# Altium project esp32-gps-collar.PrjPcb (part 1 of 2)
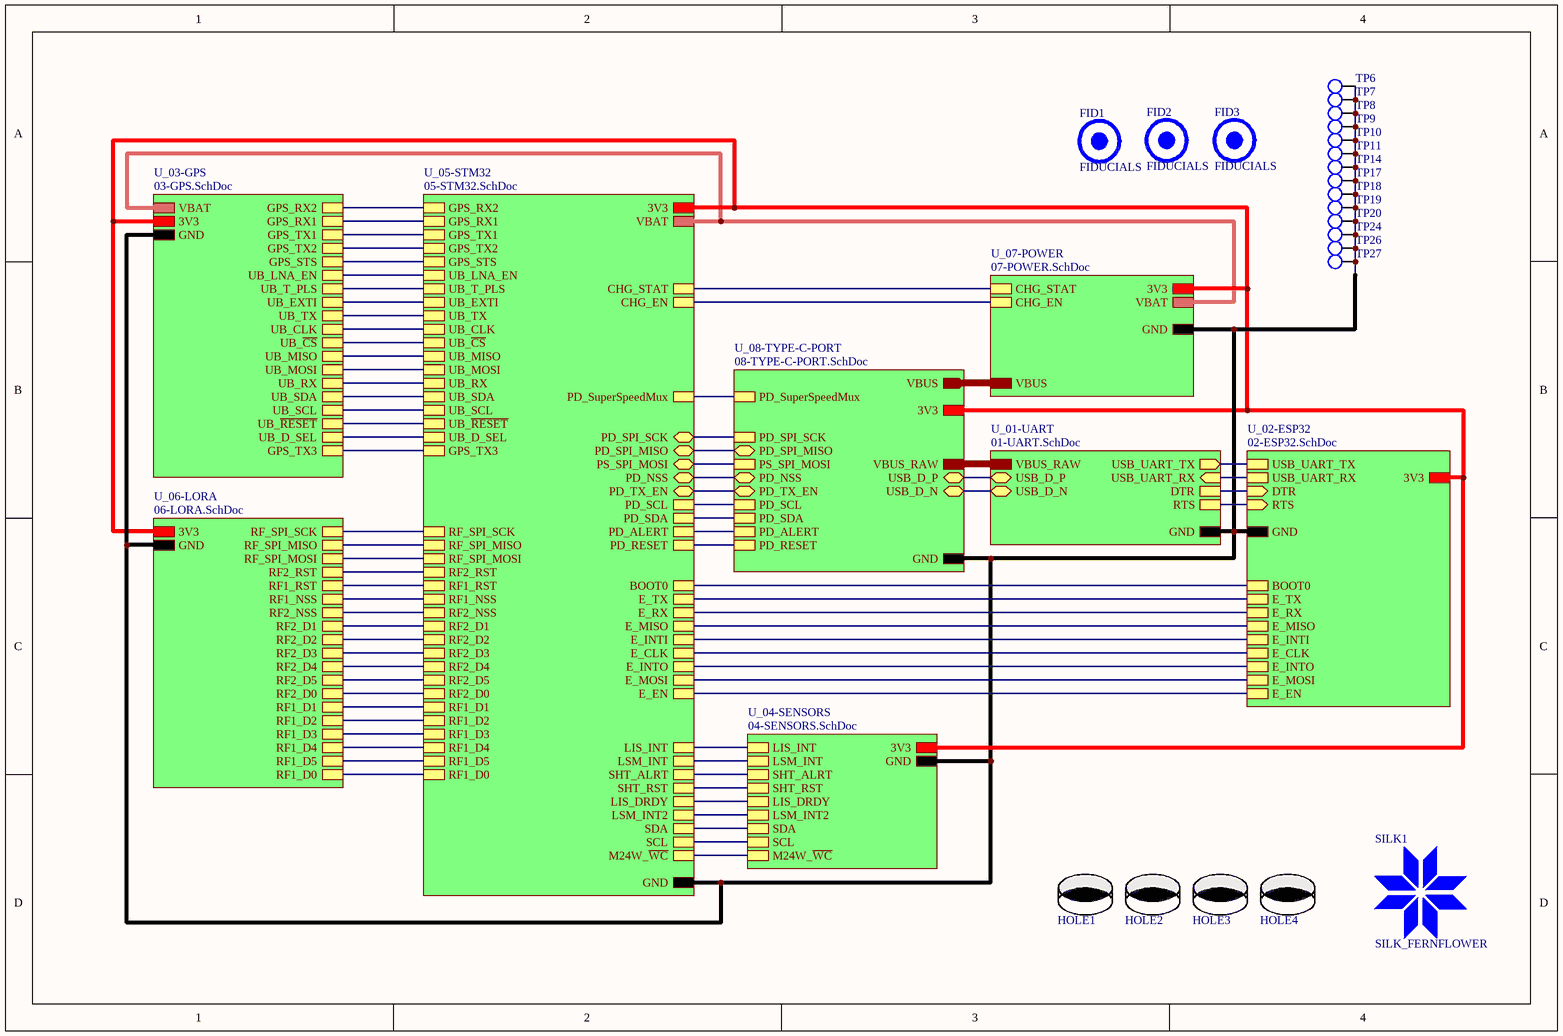
[diagram p0: 00-OVERVIEW.SchDoc]
11 sheets, 324 parts. Net scope: hierarchical (ports join the sheet entries above them; power ports are global).
Board file: SAC100001-PB-Collar.PcbDoc
Sheets:
  00-OVERVIEW.SchDoc
    U_01-UART = 01-UART.SchDoc
    U_02-ESP32 = 02-ESP32.SchDoc
    U_05-STM32 = 05-STM32.SchDoc
    U_07-POWER = 07-POWER.SchDoc
    U_08-TYPE-C-PORT = 08-TYPE-C-PORT.SchDoc
    U_03-GPS = 03-GPS.SchDoc
    U_04-SENSORS = 04-SENSORS.SchDoc
    U_06-LORA = 06-LORA.SchDoc
  000-PDN.SchDoc
  Notes.SchDoc

## Sheet 00-OVERVIEW.SchDoc
size A4

### Parts
FID1  FIDUCIALS  [FID_C_2-1]  (no BOM)
FID2  FIDUCIALS  [FID_C_5-3-1]  (no BOM)
FID3  FIDUCIALS  [FID_C_2-1]  (no BOM)
HOLE1  HOLE_M3  [HOLE_M3]  (value not drawn)  (no BOM)
HOLE2  HOLE_M3  [HOLE_M3]  (value not drawn)  (no BOM)
HOLE3  HOLE_M3  [HOLE_M3]  (value not drawn)  (no BOM)
HOLE4  HOLE_M3  [HOLE_M3]  (value not drawn)  (no BOM)
SILK1  SILK_FERNFLOWER  [SILK_FERNFLOWER]  (no BOM)
TP6  TEST_POINT  [THOOK_0.8-1]  (value not drawn)  (no BOM)
TP7  TEST_POINT  [THOOK_0.8-1]  (value not drawn)  (no BOM)
TP8  TEST_POINT  [THOOK_0.8-1]  (value not drawn)  (no BOM)
TP9  TEST_POINT  [THOOK_0.8-1]  (value not drawn)  (no BOM)
TP10  TEST_POINT  [THOOK_0.8-1]  (value not drawn)  (no BOM)
TP11  TEST_POINT  [THOOK_0.8-1]  (value not drawn)  (no BOM)
TP14  TEST_POINT  [THOOK_0.8-1]  (value not drawn)  (no BOM)
TP17  TEST_POINT  [THOOK_0.8-1]  (value not drawn)  (no BOM)
TP18  TEST_POINT  [THOOK_0.8-1]  (value not drawn)  (no BOM)
TP19  TEST_POINT  [THOOK_0.8-1]  (value not drawn)  (no BOM)
TP20  TEST_POINT  [THOOK_0.8-1]  (value not drawn)  (no BOM)
TP24  TEST_POINT  [THOOK_0.8-1]  (value not drawn)  (no BOM)
TP26  TEST_POINT  [THOOK_0.8-1]  (value not drawn)  (no BOM)
TP27  TEST_POINT  [THOOK_0.8-1]  (value not drawn)  (no BOM)

### Sub-sheets
U_01-UART = 01-UART.SchDoc: GND, VBUS_RAW, USB_D_P (bidir), USB_UART_TX (out), USB_UART_RX (in), DTR, RTS, USB_D_N (bidir)
U_02-ESP32 = 02-ESP32.SchDoc: USB_UART_RX, GND, 3V3, DTR (in), RTS (in), USB_UART_TX, E_EN, E_MISO, E_INTI, E_CLK, E_INTO, E_MOSI, E_TX, E_RX, BOOT0
U_03-GPS = 03-GPS.SchDoc: GPS_RX2, GPS_RX1, GPS_TX1, GPS_TX2, GPS_STS, UB_LNA_EN, UB_T_PLS, UB_EXTI, UB_TX, UB_CLK, UB_~{CS}, UB_MISO, UB_MOSI, UB_RX, UB_SDA, UB_SCL, UB_~{RESET}, VBAT, 3V3, GND, UB_D_SEL, GPS_TX3
U_04-SENSORS = 04-SENSORS.SchDoc: LIS_INT, LSM_INT, SHT_ALRT, SHT_RST, LIS_DRDY, GND, 3V3, LSM_INT2, SCL, SDA, M24W_~{WC}
U_05-STM32 = 05-STM32.SchDoc: CHG_EN, PD_SuperSpeedMux, PD_TX_EN (bidir), PD_SDA, PD_RESET, GND, PD_NSS (bidir), CHG_STAT, E_MISO, E_INTI, E_CLK, E_INTO, E_MOSI, E_EN, PS_SPI_MOSI (bidir), PD_SPI_SCK (bidir), PD_SPI_MISO (bidir), BOOT0, E_RX, E_TX, PD_ALERT, VBAT, 3V3, PD_SCL, UB_D_SEL, UB_TX, UB_~{CS}, UB_~{RESET}, UB_LNA_EN, GPS_STS, GPS_RX2, GPS_RX1, GPS_TX1, GPS_TX2, GPS_TX3, UB_EXTI, UB_T_PLS, UB_RX, UB_SDA, UB_MISO, UB_MOSI, UB_SCL, UB_CLK, LIS_INT, SHT_ALRT, SHT_RST, LSM_INT, LIS_DRDY, SCL, SDA, LSM_INT2, RF_SPI_MISO, RF_SPI_MOSI, RF2_RST, RF1_RST, RF1_NSS, RF_SPI_SCK, RF1_D3, RF1_D4, RF2_D3, RF1_D5, RF1_D0, RF1_D1, RF2_D0, RF2_D2, RF2_D5, RF1_D2, RF2_D4, RF2_D1, RF2_NSS, M24W_~{WC}
U_06-LORA = 06-LORA.SchDoc: RF_SPI_MISO, RF_SPI_MOSI, RF2_RST, RF1_RST, RF1_NSS, RF2_NSS, RF2_D1, RF2_D2, RF2_D3, RF2_D4, RF2_D5, RF2_D0, RF1_D1, RF1_D2, RF1_D3, RF1_D4, RF1_D5, RF1_D0, RF_SPI_SCK, 3V3, GND
U_07-POWER = 07-POWER.SchDoc: VBAT, GND, 3V3, VBUS, CHG_EN, CHG_STAT
U_08-TYPE-C-PORT = 08-TYPE-C-PORT.SchDoc: PD_SuperSpeedMux, PD_SPI_MISO (bidir), PD_NSS (bidir), PD_TX_EN (bidir), PD_SCL, PD_SDA, PD_ALERT, PD_RESET, GND, 3V3, VBUS_RAW, USB_D_P (bidir), PD_SPI_SCK, USB_D_N (bidir), VBUS (out), PS_SPI_MOSI

### Nets
3V3: sheet U_02-ESP32/3V3, sheet U_05-STM32/3V3, sheet U_07-POWER/3V3, sheet U_08-TYPE-C-PORT/3V3, sheet U_03-GPS/3V3, sheet U_04-SENSORS/3V3, sheet U_06-LORA/3V3
GND: TP6.1 TP7.1 TP8.1 TP9.1 TP10.1 TP11.1 TP14.1 TP17.1 TP18.1 TP19.1 TP20.1 TP24.1 TP26.1 TP27.1 ; sheet U_01-UART/GND, sheet U_02-ESP32/GND, sheet U_05-STM32/GND, sheet U_07-POWER/GND, sheet U_08-TYPE-C-PORT/GND, sheet U_03-GPS/GND, sheet U_04-SENSORS/GND, sheet U_06-LORA/GND
VBUS: sheet U_07-POWER/VBUS, sheet U_08-TYPE-C-PORT/VBUS
BOOT0: sheet U_02-ESP32/BOOT0, sheet U_05-STM32/BOOT0
C_D0_N: sheet U_01-UART/USB_D_N, sheet U_08-TYPE-C-PORT/USB_D_N
C_D0_P: sheet U_01-UART/USB_D_P, sheet U_08-TYPE-C-PORT/USB_D_P
CHG_ENr: sheet U_05-STM32/CHG_EN, sheet U_07-POWER/CHG_EN
CHG_STATr: sheet U_05-STM32/CHG_STAT, sheet U_07-POWER/CHG_STAT
CPRX: sheet U_01-UART/USB_UART_RX, sheet U_02-ESP32/USB_UART_RX
CPTX: sheet U_01-UART/USB_UART_TX, sheet U_02-ESP32/USB_UART_TX
DTR: sheet U_01-UART/DTR, sheet U_02-ESP32/DTR
E_CLK: sheet U_02-ESP32/E_CLK, sheet U_05-STM32/E_CLK
E_EN: sheet U_02-ESP32/E_EN, sheet U_05-STM32/E_EN
E_INTI: sheet U_02-ESP32/E_INTI, sheet U_05-STM32/E_INTI
E_INTO: sheet U_02-ESP32/E_INTO, sheet U_05-STM32/E_INTO
E_MISO: sheet U_02-ESP32/E_MISO, sheet U_05-STM32/E_MISO
E_MOSI: sheet U_02-ESP32/E_MOSI, sheet U_05-STM32/E_MOSI
E_RX: sheet U_02-ESP32/E_RX, sheet U_05-STM32/E_RX
E_TX: sheet U_02-ESP32/E_TX, sheet U_05-STM32/E_TX
GPS_TX3: sheet U_05-STM32/GPS_TX3, sheet U_03-GPS/GPS_TX3
GPS_VBAT: sheet U_05-STM32/VBAT, sheet U_07-POWER/VBAT, sheet U_03-GPS/VBAT
LIS_INT: sheet U_05-STM32/LIS_INT, sheet U_04-SENSORS/LIS_INT
M24W_WC: sheet U_05-STM32/M24W_~{WC}, sheet U_04-SENSORS/M24W_~{WC}
PD_ALERT: sheet U_05-STM32/PD_ALERT, sheet U_08-TYPE-C-PORT/PD_ALERT
PD_RESET: sheet U_05-STM32/PD_RESET, sheet U_08-TYPE-C-PORT/PD_RESET
PD_SSMUX: sheet U_05-STM32/PD_SuperSpeedMux, sheet U_08-TYPE-C-PORT/PD_SuperSpeedMux
PD_TX_EN: sheet U_05-STM32/PD_TX_EN, sheet U_08-TYPE-C-PORT/PD_TX_EN
PDI2C_SCL: sheet U_05-STM32/PD_SCL, sheet U_08-TYPE-C-PORT/PD_SCL
PDI2C_SDA: sheet U_05-STM32/PD_SDA, sheet U_08-TYPE-C-PORT/PD_SDA
PDSPI_MISO: sheet U_05-STM32/PD_SPI_MISO, sheet U_05-STM32/UB_MISO, sheet U_08-TYPE-C-PORT/PD_SPI_MISO, sheet U_03-GPS/UB_MISO
PDSPI_MOSI: sheet U_05-STM32/PS_SPI_MOSI, sheet U_05-STM32/UB_MOSI, sheet U_08-TYPE-C-PORT/PS_SPI_MOSI, sheet U_03-GPS/UB_MOSI
PDSPI_NSS: sheet U_05-STM32/PD_NSS, sheet U_08-TYPE-C-PORT/PD_NSS
PDSPI_SCK: sheet U_05-STM32/PD_SPI_SCK, sheet U_05-STM32/UB_CLK, sheet U_08-TYPE-C-PORT/PD_SPI_SCK, sheet U_03-GPS/UB_CLK
RF1_D0: sheet U_05-STM32/RF1_D0, sheet U_06-LORA/RF1_D0
RF1_D1: sheet U_05-STM32/RF1_D1, sheet U_06-LORA/RF1_D1
RF1_D2: sheet U_05-STM32/RF1_D2, sheet U_06-LORA/RF1_D2
RF1_D3: sheet U_05-STM32/RF1_D3, sheet U_06-LORA/RF1_D3
RF1_D4: sheet U_05-STM32/RF1_D4, sheet U_06-LORA/RF1_D4
RF1_D5: sheet U_05-STM32/RF1_D5, sheet U_06-LORA/RF1_D5
RF1_NSS: sheet U_05-STM32/RF1_NSS, sheet U_06-LORA/RF1_NSS
RF1_RST: sheet U_05-STM32/RF1_RST, sheet U_06-LORA/RF1_RST
RF2_D0: sheet U_05-STM32/RF2_D0, sheet U_06-LORA/RF2_D0
RF2_D1: sheet U_05-STM32/RF2_D1, sheet U_06-LORA/RF2_D1
RF2_D2: sheet U_05-STM32/RF2_D2, sheet U_06-LORA/RF2_D2
RF2_D3: sheet U_05-STM32/RF2_D3, sheet U_06-LORA/RF2_D3
RF2_D4: sheet U_05-STM32/RF2_D4, sheet U_06-LORA/RF2_D4
RF2_D5: sheet U_05-STM32/RF2_D5, sheet U_06-LORA/RF2_D5
RF2NSS: sheet U_05-STM32/RF2_NSS, sheet U_06-LORA/RF2_NSS
RF2RST: sheet U_05-STM32/RF2_RST, sheet U_06-LORA/RF2_RST
RF_MISO: sheet U_05-STM32/RF_SPI_MISO, sheet U_06-LORA/RF_SPI_MISO
RF_MOSI: sheet U_05-STM32/RF_SPI_MOSI, sheet U_06-LORA/RF_SPI_MOSI
RF_SCK: sheet U_05-STM32/RF_SPI_SCK, sheet U_06-LORA/RF_SPI_SCK
RTS: sheet U_01-UART/RTS, sheet U_02-ESP32/RTS
SCL: sheet U_05-STM32/SCL, sheet U_04-SENSORS/SCL
SDA: sheet U_05-STM32/SDA, sheet U_04-SENSORS/SDA
SHT_ALERT: sheet U_05-STM32/SHT_ALRT, sheet U_04-SENSORS/SHT_ALRT
SHT_RST: sheet U_05-STM32/SHT_RST, sheet U_04-SENSORS/SHT_RST
UB_~{CS}: sheet U_05-STM32/UB_~{CS}, sheet U_03-GPS/UB_~{CS}
UB_EXTI: sheet U_05-STM32/UB_EXTI, sheet U_03-GPS/UB_EXTI
UB_LNA_EN: sheet U_05-STM32/UB_LNA_EN, sheet U_03-GPS/UB_LNA_EN
UB_~{RST}: sheet U_05-STM32/UB_~{RESET}, sheet U_03-GPS/UB_~{RESET}
UB_RX: sheet U_05-STM32/UB_RX, sheet U_03-GPS/UB_RX
UB_SCL: sheet U_05-STM32/UB_SCL, sheet U_03-GPS/UB_SCL
UB_SDA: sheet U_05-STM32/UB_SDA, sheet U_03-GPS/UB_SDA
UB_TPULS: sheet U_05-STM32/UB_T_PLS, sheet U_03-GPS/UB_T_PLS
UB_TX: sheet U_05-STM32/UB_TX, sheet U_03-GPS/UB_TX
VBUS_RAW: sheet U_01-UART/VBUS_RAW, sheet U_08-TYPE-C-PORT/VBUS_RAW
NetCFG7_1: sheet U_05-STM32/LSM_INT2, sheet U_04-SENSORS/LSM_INT2
NetJ2_2: sheet U_05-STM32/GPS_RX2, sheet U_03-GPS/GPS_RX2
NetJ3_2: sheet U_05-STM32/GPS_TX2, sheet U_03-GPS/GPS_TX2
NetJ4_2: sheet U_05-STM32/GPS_TX1, sheet U_03-GPS/GPS_TX1
NetJ5_2: sheet U_05-STM32/GPS_RX1, sheet U_03-GPS/GPS_RX1
NetR12_1: sheet U_05-STM32/GPS_STS, sheet U_03-GPS/GPS_STS
NetR21_1: sheet U_05-STM32/UB_D_SEL, sheet U_03-GPS/UB_D_SEL
NetR23_1: sheet U_05-STM32/LIS_DRDY, sheet U_04-SENSORS/LIS_DRDY
NetU8_4: sheet U_05-STM32/LSM_INT, sheet U_04-SENSORS/LSM_INT

Not connected (* = marked no-connect by the designer): HOLE1 4; HOLE2 4; HOLE3 4; HOLE4 4

## Sheet 01-UART.SchDoc
size A4; DocumentNumber: 1; SheetNumber: 1; SheetTotal: 8
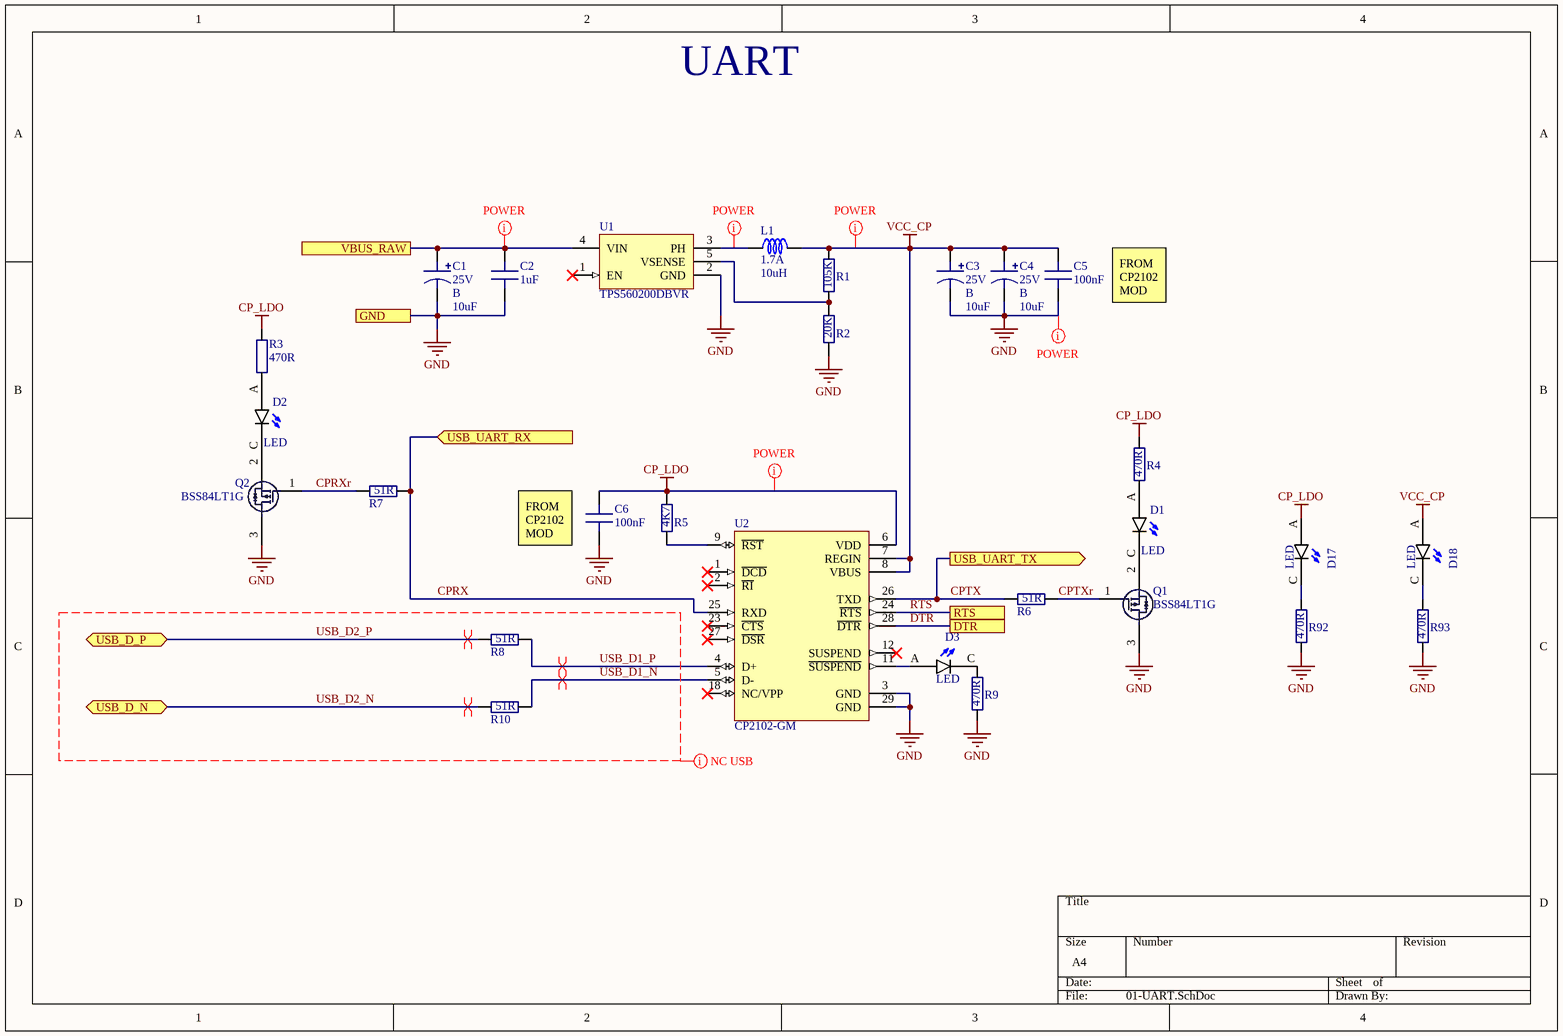
[diagram p1: 01-UART.SchDoc]

### Parts
C1  Voltage: 25V  Size: B  [CAP_SIZE_B]  (hidden comment: 10uF)
C2  1uF  [C0805]
C3  Voltage: 25V  Size: B  [CAP_SIZE_B]  (hidden comment: 10uF)
C4  Voltage: 25V  Size: B  [CAP_SIZE_B]  (hidden comment: 10uF)
C5  100nF  [C0603]
C6  100nF  [C0603]
D1  LED  [LED_0604]
D2  LED  [LED_0604]
D3  LED  [LED_0604]
D17  LED  [LED_0604]
D18  LED  [LED_0604]
L1  Current: 1.7A  Inductivity: 10uH  [L_CDRH6D28]  (hidden comment: *)
Q1  BSS84LT1G  [SOT-23_TO-236]
Q2  BSS84LT1G  [SOT-23_TO-236]
R1  Resistance: 105K  [R0603]
R2  Resistance: 20K  [R0603]
R3  Resistance: 470R  [R0603]
R4  Resistance: 470R  [R0603]
R5  Resistance: 4K7  [R0603]
R6  Resistance: 51R  [R0402]
R7  Resistance: 51R  [R0402]
R8  Resistance: 51R  [R0402]
R9  Resistance: 470R  [R0603]
R10  Resistance: 51R  [R0402]
R92  Resistance: 470R  [R0603]
R93  Resistance: 470R  [R0603]
U1  TPS560200DBVR  [SOT-23-5]
U2  CP2102-GM  [QFN50P500X500X100-29N]

### Ports
DTR, GND, RTS, USB_D_N (bidir), USB_D_P (bidir), USB_UART_RX (in), USB_UART_TX (out), VBUS_RAW

### Nets
CP_LDO: C6.2 D17.A R3.2 R4.2 R5.2 U2.6(VDD)
GND: C1.2 C2.1 C3.2 C4.2 C5.1 C6.1 Q1.3(D) Q2.3(D) R2.1 R9.1 R92.1 R93.1 U1.2(GND) U2.3(GND) U2.29(GND) ; port GND
VCC_CP: C3.1 C4.1 C5.2 D18.A L1.2 R1.2 U2.7(REGIN) U2.8(VBUS)
CPRX: R7.2 U2.25(RXD) ; port USB_UART_RX
CPRXr: Q2.1(G) R7.1
CPTX: R6.1 U2.26(TXD) ; port USB_UART_TX
CPTXr: Q1.1(G) R6.2
DTR: U2.28(~{DTR}) ; port DTR
RTS: U2.24(~{RTS}) ; port RTS
USB_D1_N: R10.2 U2.5(D-)
USB_D1_P: R8.2 U2.4(D+)
USB_D2_N: R10.1 ; port USB_D_N  [project net C_D0_N]
USB_D2_P: R8.1 ; port USB_D_P  [project net C_D0_P]
VBUS_RAW: C1.1 C2.2 U1.4(VIN) ; port VBUS_RAW
NetD1_A: D1.A R4.1
NetD1_C: D1.C Q1.2(S)
NetD2_A: D2.A R3.1
NetD2_C: D2.C Q2.2(S)
NetD3_A: D3.A U2.11(~{SUSPEND})
NetD3_C: D3.C R9.2
NetD17_C: D17.C R92.2
NetD18_C: D18.C R93.2
NetL1_1: L1.1 U1.3(PH)
NetR1_1: R1.1 R2.2 U1.5(VSENSE)
NetR5_1: R5.1 U2.9(~{RST})

Not connected (* = marked no-connect by the designer): U1 1(EN)*; U2 1(~{DCD})* 2(~{RI})* 12(SUSPEND)* 18(NC/VPP)* 23(~{CTS})* 27(~{DSR})*

### Layout directives
differential pair: C_D0_N, C_D0_P, USB_D1_N, USB_D1_P
net class USB: USB_D1_N, USB_D1_P, USB_D2_N, USB_D2_P
net class POWER_NET_CLASS: CP_LDO, GND, NetL1_1, VBUS_RAW, VCC_CP

### Notes on the sheet
- UART
- FROM
  CP2102
  MOD
- (near C6) FROM
  CP2102
  MOD

### Library data of the parts
C1 C3 C4 = CAP_B_10uF_25V: Tantalum capacitor; Capacity: 10uF; Value: 10uF
C2 = C0805_1uF_25V: Ceramic capacitor; Voltage: 25V; Capacity: 1uF; Size: 0805; Value: 1uF
C5 C6 = C0603_100nF_16V: Ceramic capacitor; Voltage: 16V; Capacity: 100nF; Size: 0603; Value: 100nF
D1-D3 D17 D18 = LED: Led General; MF: Dialight; MP: 598-8140-107F; SnapEDA_Link: https://www.snapeda.com/parts/598-8140-107F/Dialight/view-part/?ref=snap; Price: None; Availability: Unavailable; Package: 0805 Dialight; Value: *
L1 = L_CDRH6D28_10uH_1.7A: Inductor Generic; Value: *; Size: CDHR6D28; Url: http://www.kosmodrom.com.ua/el.php?name=CDRH6D28NP-100NC
Q1 Q2 = BSS84LT1G: Power MOSFET Single P-Channel SOT-23 -50 V, 10 
R1 = R0603_105K_1%: Resistor General; Tolerance: 1%; Size: 0603
R2 = R0603_20K_1%: Resistor General; Tolerance: 1%; Size: 0603
R3 R4 R9 R92 R93 = R0603_470R: Resistor General; Tolerance: 5%; Size: 0603
R5 = R0603_4K7: Resistor General; Tolerance: 5%; Size: 0603
R6-R8 R10 = R0402_51R: Resistor General; Tolerance: *; Size: 0402
U1 = TPS560200DBVR: TPS560200 4.5-V to 17-V Input, 500-mA Synchronous Step-Down Converter With Advanced Eco-Mode™
U2 = CP2102-GM: SINGLE-CHIP USB-TO-UART BRIDGE; MP: CP2102GM; MF: Silicon Labs; Availability: Unavailable; Package: VFQFN-28 Vishay Siliconix; Price: None; SnapEDA_Link: https://www.snapeda.com/parts/CP2102GM/Silicon%20Labs/view-part/?ref=snap; Value: *

## Sheet 02-ESP32.SchDoc
size A4; DocumentNumber: 2; SheetNumber: 2; SheetTotal: 8
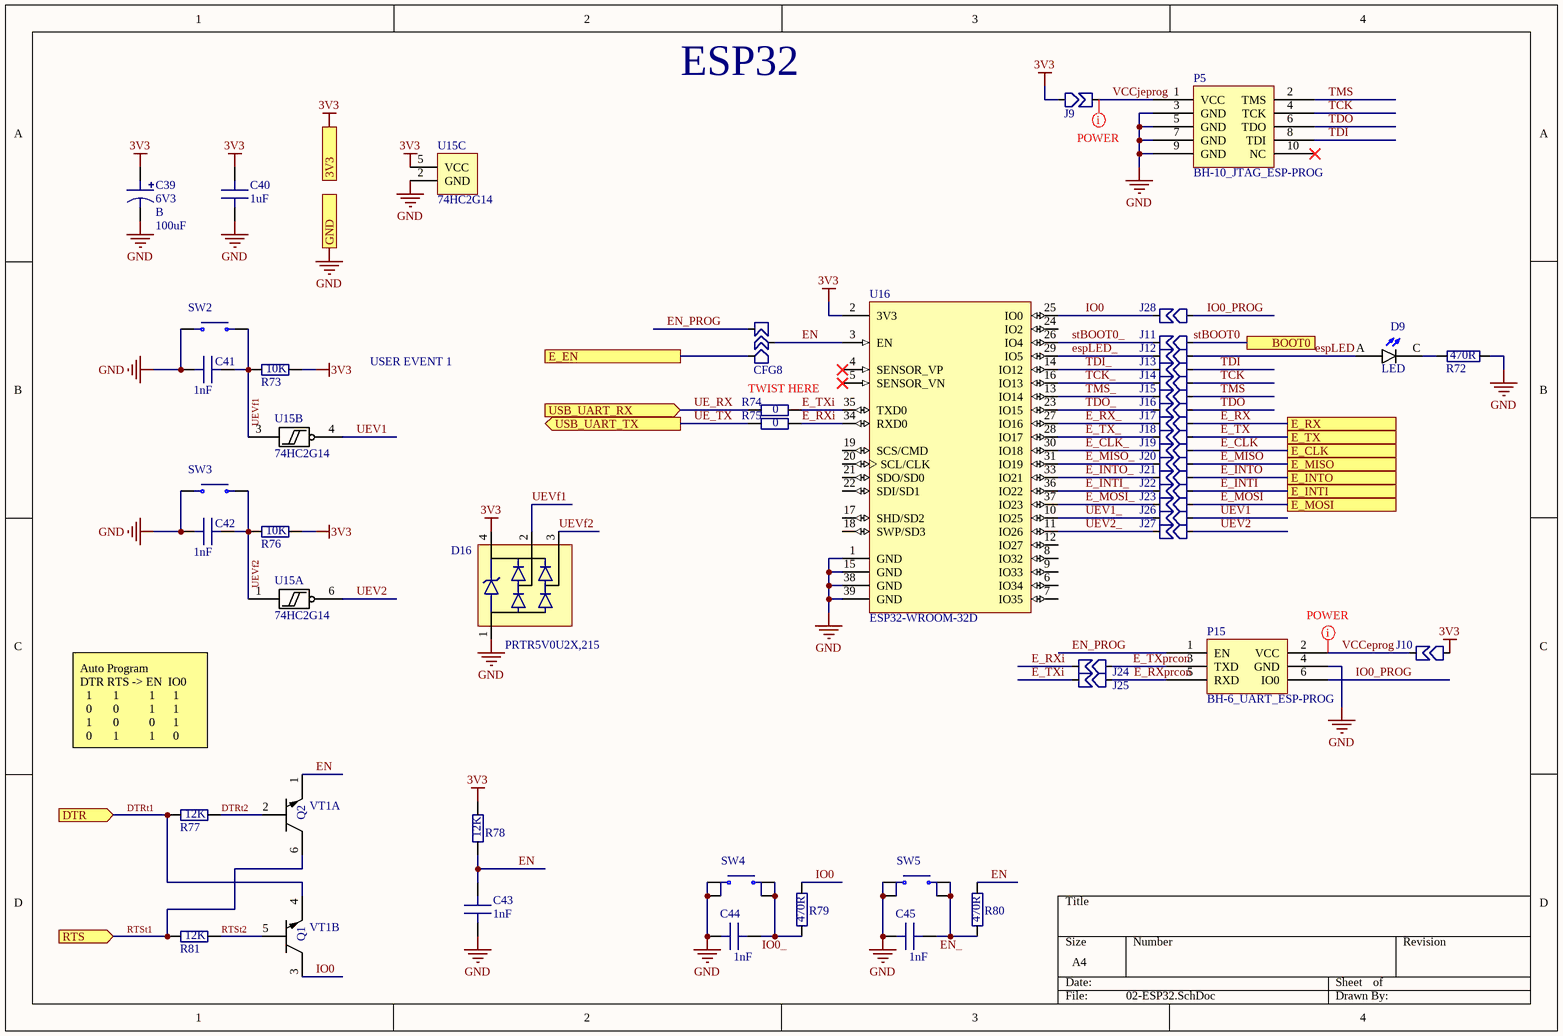
[diagram p2: 02-ESP32.SchDoc]

### Parts
C39  Voltage: 6V3  Size: B  [CAP_SIZE_B]  (hidden comment: 100uF)
C40  1uF  [C0805]
C41  1nF  [C0603]
C42  1nF  [C0603]
C43  1nF  [C0603]
C44  1nF  [C0603]
C45  1nF  [C0603]
CFG8  CFG3_ORTH  [CFG_0603]  (value not drawn)  (no BOM)
D9  LED  [LED_0604]
D16  PRTR5V0U2X,215  [SOT143B]
J9  CFG2  [CFG_J_0603]  (value not drawn)  (no BOM)
J10  CFG2  [CFG_J_0603]  (value not drawn)  (no BOM)
J11  CFG2  [CFG_J_0603]  (value not drawn)  (no BOM)
J12  CFG2  [CFG_J_0603]  (value not drawn)  (no BOM)
J13  CFG2  [CFG_J_0603]  (value not drawn)  (no BOM)
J14  CFG2  [CFG_J_0603]  (value not drawn)  (no BOM)
J15  CFG2  [CFG_J_0603]  (value not drawn)  (no BOM)
J16  CFG2  [CFG_J_0603]  (value not drawn)  (no BOM)
J17  CFG2  [CFG_J_0603]  (value not drawn)  (no BOM)
J18  CFG2  [CFG_J_0603]  (value not drawn)  (no BOM)
J19  CFG2  [CFG_J_0603]  (value not drawn)  (no BOM)
J20  CFG2  [CFG_J_0603]  (value not drawn)  (no BOM)
J21  CFG2  [CFG_J_0603]  (value not drawn)  (no BOM)
J22  CFG2  [CFG_J_0603]  (value not drawn)  (no BOM)
J23  CFG2  [CFG_J_0603]  (value not drawn)  (no BOM)
J24  CFG2  [CFG_J_0603]  (value not drawn)  (no BOM)
J25  CFG2  [CFG_J_0603]  (value not drawn)  (no BOM)
J26  CFG2  [CFG_J_0603]  (value not drawn)  (no BOM)
J27  CFG2  [CFG_J_0603]  (value not drawn)  (no BOM)
J28  CFG2  [CFG_J_0603]  (value not drawn)  (no BOM)
P5  BH-10_JTAG_ESP-PROG  [BH-10-SMD-1.27]
P15  BH-6_UART_ESP-PROG  [BH-6-SMD-1.27]
R72  Resistance: 470R  [R0603]
R73  Resistance: 10K  [R0603]
R74  Resistance: 0  [R0402]
R75  Resistance: 0  [R0402]
R76  Resistance: 10K  [R0603]
R77  Resistance: 12K  [R0603]
R78  Resistance: 12K  [R0603]
R79  Resistance: 470R  [R0603]
R80  Resistance: 470R  [R0603]
R81  Resistance: 12K  [R0603]
SW2  SWITCH_GEN_2P  [SW_TACTM-35N-F]  (value not drawn)
SW3  SWITCH_GEN_2P  [SW_TACTM-35N-F]  (value not drawn)
SW4  SWITCH_GEN_4P  [SW_4x4x1.5]  (value not drawn)
SW5  SWITCH_GEN_4P  [SW_4x4x1.5]  (value not drawn)
U15  74HC2G14  [SOT363/SOT65P210X110-6N]  (parts A,B,C of 3)
U16  ESP32-WROOM-32D  [ESP32-WROOM-32]
VT1  BC847BDW1T1G  [SOT363/SOT65P210X110-6N]  (value not drawn)  (parts A,B of 2)

### Ports
3V3, BOOT0, DTR (in), E_CLK, E_EN, E_INTI, E_INTO, E_MISO, E_MOSI, E_RX, E_TX, GND, RTS (in), USB_UART_RX (in), USB_UART_TX (out)

### Nets
3V3: C39.1 C40.2 D16.4(P$4) J9.2(IN) J10.2(IN) R73.2 R76.2 R78.2 U15.5(VCC) U16.2(3V3) ; port 3V3
GND: C39.2 C40.1 C41.2 C42.2 C43.1 C44.1 C45.1 D16.1(P$1) P5.3(GND) P5.5(GND) P5.7(GND) P5.9(GND) P15.4(GND) R72.2 SW2.1 SW3.1 SW4.1 SW4.3 SW5.1 SW5.3 U15.2(GND) U16.1(GND) U16.15(GND) U16.38(GND) U16.39(GND) ; port GND
DTRt1: R77.1 VT1.4 ; port DTR  [project net DTR]
DTRt2: R77.2 VT1.2
E_CLK: J19.2(IN) ; port E_CLK
E_CLK_: J19.1(A) U16.30(IO18)
E_EN: CFG8.3(B) ; port E_EN
E_INTI: J22.2(IN) ; port E_INTI
E_INTI_: J22.1(A) U16.36(IO22)
E_INTO: J21.2(IN) ; port E_INTO
E_INTO_: J21.1(A) U16.33(IO21)
E_MISO: J20.2(IN) ; port E_MISO
E_MISO_: J20.1(A) U16.31(IO19)
E_MOSI: J23.2(IN) ; port E_MOSI
E_MOSI_: J23.1(A) U16.37(IO23)
E_RX: J17.2(IN) ; port E_RX
E_RX_: J17.1(A) U16.27(IO16)
E_RXi: J24.1(A) R75.2 U16.34(RXD0)
E_RXprcon: J25.2(IN) P15.5(RXD)
E_TX: J18.2(IN) ; port E_TX
E_TX_: J18.1(A) U16.28(IO17)
E_TXi: J25.1(A) R74.2 U16.35(TXD0)
E_TXprcon: J24.2(IN) P15.3(TXD)
EN: C43.2 CFG8.2(IN) R78.1 R80.2 U16.3(EN) VT1.1
EN_: C45.2 R80.1 SW5.2 SW5.4
EN_PROG: CFG8.1(A) P15.1(EN)
espLED: D9.A J12.2(IN)
espLED_: J12.1(A) U16.29(IO5)
IO0: J28.1(A) R79.2 U16.25(IO0) VT1.3
IO0_: C44.2 R79.1 SW4.2 SW4.4
IO0_PROG: J28.2(IN) P15.6(IO0)
RTSt1: R81.1 VT1.6 ; port RTS  [project net RTS]
RTSt2: R81.2 VT1.5
stBOOT0: J11.2(IN) ; port BOOT0  [project net BOOT0]
stBOOT0_: J11.1(A) U16.26(IO4)
TCK: J14.2(IN) P5.4(TCK)
TCK_: J14.1(A) U16.16(IO13)
TDI: J13.2(IN) P5.8(TDI)
TDI_: J13.1(A) U16.14(IO12)
TDO: J16.2(IN) P5.6(TDO)
TDO_: J16.1(A) U16.23(IO15)
TMS: J15.2(IN) P5.2(TMS)
TMS_: J15.1(A) U16.13(IO14)
UE_RX: R74.1 ; port USB_UART_RX  [project net CPRX]
UE_TX: R75.1 ; port USB_UART_TX  [project net CPTX]
UEV1: J26.2(IN) U15.4(2Y)
UEV1_: J26.1(A) U16.10(IO25)
UEV2: J27.2(IN) U15.6(1Y)
UEV2_: J27.1(A) U16.11(IO26)
UEVf1: C41.1 D16.2(P$2) R73.1 SW2.2 U15.3(2A)
UEVf2: C42.1 D16.3(P$3) R76.1 SW3.2 U15.1(1A)
VCCeprog: J10.1(A) P15.2(VCC)
VCCjeprog: J9.1(A) P5.1(VCC)
NetD9_C: D9.C R72.1

Not connected (* = marked no-connect by the designer): P5 10(NC)*; U16 4(SENSOR_VP)* 5(SENSOR_VN)* 6(IO34) 7(IO35) 8(IO32) 9(IO33) 12(IO27) 17(SHD/SD2) 18(SWP/SD3) 19(SCS/CMD) 20(SCL/CLK) 21(SDO/SD0) 22(SDI/SD1) 24(IO2)

### Layout directives
net class POWER_NET_CLASS: VCCeprog, VCCjeprog

### Notes on the sheet
- ESP32
- USER EVENT 1
- (near R74) TWIST HERE
- Auto Program
  DTR RTS -> EN  IO0
  1       1          1      1
  0       0          1      1
  1       0          0      1
  0       1          1      0
- (in symbol BC847BDW1T1G, part A) Q2
- (in symbol BC847BDW1T1G, part B) Q1

### Library data of the parts
C39 = CAP_B_100uF_6V3: Tantalum capacitor; Capacity: 100uF; Value: 100uF; PriceRCSUAH: 5,5; RCS: https://www.rcscomponents.kiev.ua/product/100uf-6-3v-size-b-10-tajb107k006rnj-avx-kondensator-tantalovyj-smd_39633.html
C40 = C0805_1uF_25V: Ceramic capacitor; Voltage: 25V; Capacity: 1uF; Size: 0805; Value: 1uF; PriceKosmodromUAH: 1; Kosmodrom: http://www.kosmodrom.com.ua/el.php?name=CP0805125V10
C41-C45 = C0603_1nF_25V: Ceramic capacitor; Voltage: 25V; Capacity: 1nF; Size: 0603; Value: 1nF; PriceKosmodromUAH: 0,75; Kosmodrom: http://www.kosmodrom.com.ua/el.php?name=CP0603100050V10
D9 = LED: Led General; MF: Dialight; MP: 598-8140-107F; Owned: 3000; SnapEDA_Link: https://www.snapeda.com/parts/598-8140-107F/Dialight/view-part/?ref=snap; Price: None; Availability: Unavailable; Package: 0805 Dialight; Value: *
D16 = PRTR5V0U2X,215: PRTR5V0U2X - Ultra low capacitance double rail-to-rail ESD protection diode; MF: Nexperia USA; Owned: 10; Package: SOT-143 Nexperia; Price: None; Availability: Unavailable; MP: PRTR5V0U2X,215; SnapEDA_Link: https://www.snapeda.com/parts/PRTR5V0U2X%2C215/Nexperia%20USA%20Inc./view-part/?ref=snap; Value: *; PriceKosmodromUAH: 3,25; Kosmodrom: http://www.kosmodrom.com.ua/el.php?name=PRTR5V0U2X.215
P5 = BH-10_JTAG_ESP-PROG: 1,27 mm 2x5 Header; Owned: 10; PriceKosmodromUAH: 7; Kosmodrom: http://www.kosmodrom.com.ua/el.php?name=BH1.27SMD-10
P15 = BH-6_UART_ESP-PROG: 1,27 mm 2x3 Header; Owned: 20; PriceAliexpress: 7; Aliexpress: https://www.aliexpress.com/item/4000400690967.html?spm=a2g0s.9042311.0.0.cbd34c4duRVTSV
R72 R79 R80 = R0603_470R: Resistor General; Tolerance: 5%; Owned: 3000; Size: 0603
R73 R76 = R0603_10K: Resistor General; Tolerance: 5%; Owned: 3000; Size: 0603; PriceRCSUAH: 0,06; RCS: https://www.rcscomponents.kiev.ua/product/10-kohm-5-0-1w-50v-0603-rc0603jr-0710kl-yageo_107096.html
R74 R75 = R0402_0R: Resistor General; Tolerance: *; Size: 0402; PriceKosmodromUAH: 0,04; PriceRCSUAH: 0,05; Kosmodrom: http://www.kosmodrom.com.ua/el.php?name=0402SMDRES0OM5; RCS: https://www.rcscomponents.kiev.ua/product/0-ohm-0402-wr04x000ptl-walsin_105536.html
R77 R78 R81 = R0603_12K: Resistor General; Tolerance: 5%; Owned: 3000; Size: 0603; PriceRCSUAH: 0,06; RCS: https://www.rcscomponents.kiev.ua/product/12-kohm-5-0-1w-50v-0603-rc0603jr-12k0-hitano-rezistor-smd_1014.html
SW2 SW3 = SWITCH_GEN_2P: SWITCH DIP 4.3 mm; PriceKosmodromUAH: 1,25; Kosmodrom: http://www.kosmodrom.com.ua/el.php?name=TACT-35N-F
SW4 SW5 = SWITCH_GEN_4P: SWITCH DIP 4.3 mm; PriceKosmodromUAH: 0,5; Kosmodrom: http://www.kosmodrom.com.ua/el.php?name=TACT-5X5X1.5
U15 = 74HC2G14: Dual inverting Schmitt trigger; PriceKosmodromUAH: 4,5; Kosmodrom: http://www.kosmodrom.com.ua/el.php?name=74HC2G14GW.125
U16 = ESP32-WROOM-32D: / IC: SoC; GPIO, I2C, I2S, IR, SD, SDIO, SPI, UART; 2.7Г·3.6VDC; 20dBm /; MF: Espressif Systems; Owned: 2; MP: ESP32-WROOM-32D; Package: Module Espressif Systems; Availability: Unavailable; Price: None; SnapEDA_Link: https://www.snapeda.com/parts/ESP32-WROOM-32D/Espressif%20Systems/view-part/?ref=snap; Value: *; PriceUAH: 135; PriceAliexpress: 2,5; OtherUA: https://www.olx.ua/uk/obyavlenie/esp-wroom-32-esp-32-module-IDGzoQv.html; Aliexpress: https://www.aliexpress.com/item/32963147246.html
VT1 = BC847BDW1T1G: Dual General Purpose Transistors NPN SOT 363; PriceKosmodromUAH: 1,5; Kosmodrom: http://www.kosmodrom.com.ua/el.php?name=BC847BDW1T1G

## Sheet 05-STM32.SchDoc
size A4; DocumentNumber: 5; SheetNumber: 5; SheetTotal: 8
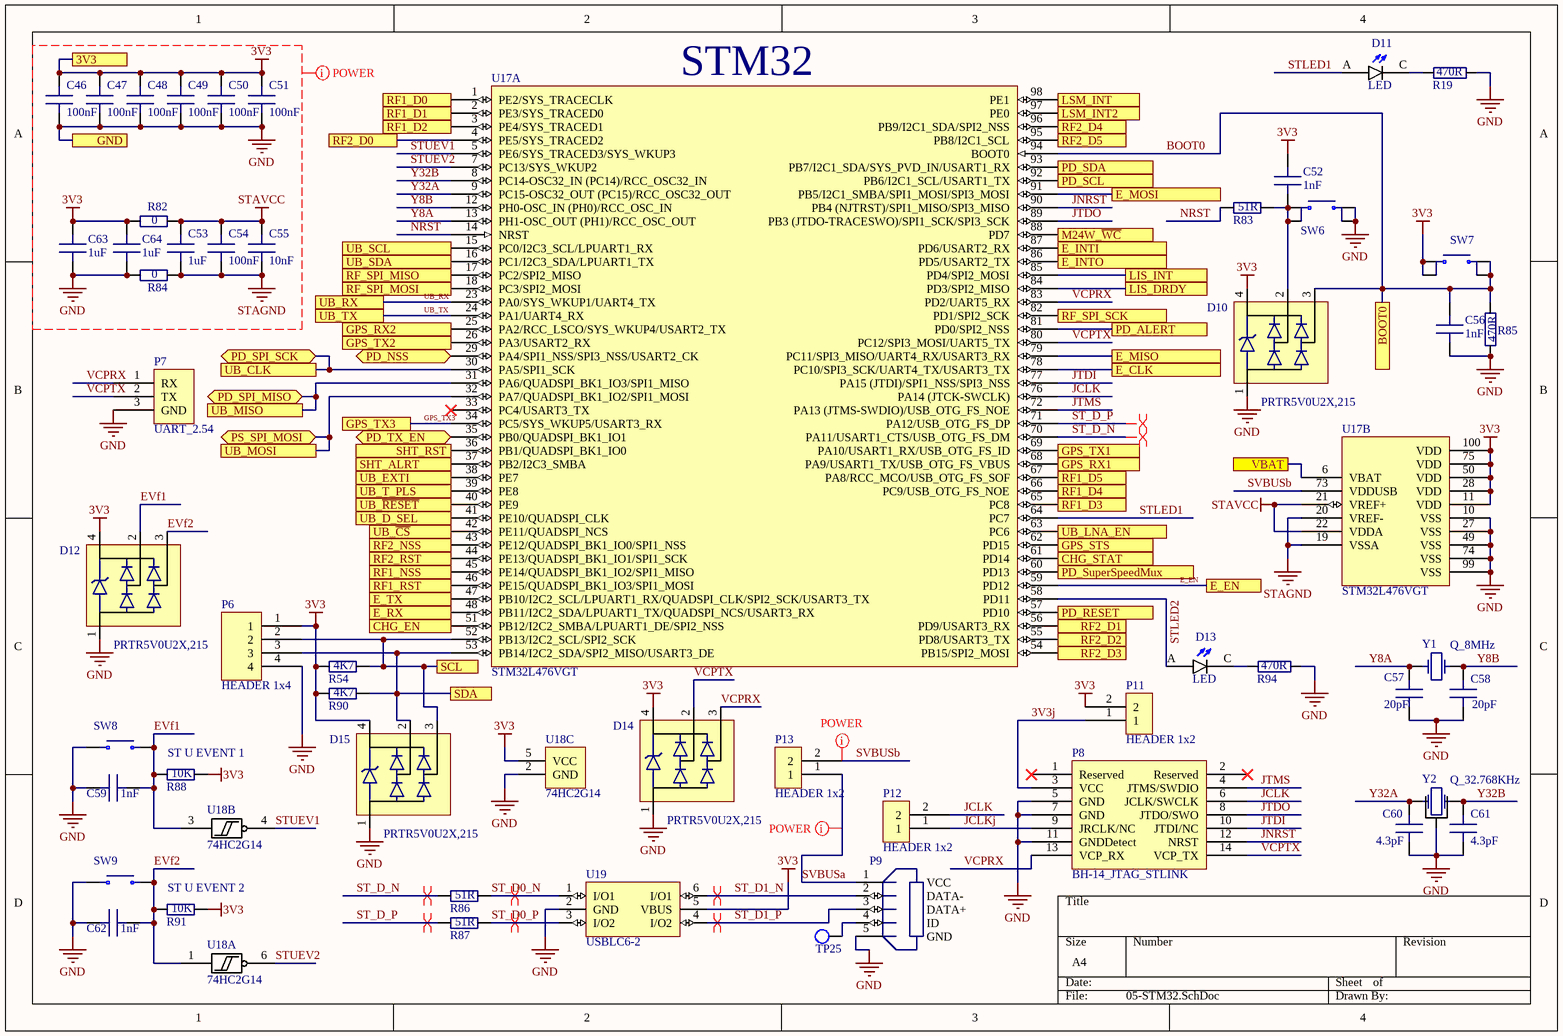
[diagram p3: 05-STM32.SchDoc]

### Parts
C46  100nF  [C0603]
C47  100nF  [C0603_NOSILK]
C48  100nF  [C0603]
C49  100nF  [C0603]
C50  100nF  [C0603]
C51  100nF  [C0603]
C52  1nF  [C0603]
C53  1uF  [C0805]
C54  100nF  [C0603]
C55  10nF  [C0603]
C56  1nF  [C0603]
C57  20pF  [C0603]
C58  20pF  [C0603]
C59  1nF  [C0603]
C60  4.3pF  [C0603]
C61  4.3pF  [C0603]
C62  1nF  [C0603]
C63  1uF  [C0805]
C64  1uF  [C0805]
D10  PRTR5V0U2X,215  [SOT143B]
D11  LED  [LED_0604]
D12  PRTR5V0U2X,215  [SOT143B]
D13  LED  [LED_0604]
D14  PRTR5V0U2X,215  [SOT143B]
D15  PRTR5V0U2X,215  [SOT143B]
P6  HEADER 1x4  [HEADER 1x4 2.54]
P7  UART_2.54  [UART_2.54]
P8  BH-14_JTAG_STLINK  [BH-14-1.27]
P9  440247-2  [CON-UUSB-F-2]  (value not drawn)
P11  HEADER 1x2  [HEADER 1x2 2.54]
P12  HEADER 1x2  [HEADER 1x2 2.54]
P13  HEADER 1x2  [HEADER 1x2 2.54]
R19  Resistance: 470R  [R0603]
R54  Resistance: 4K7  [R0603]
R82  Resistance: 0  [R0603]
R83  Resistance: 51R  [R0402]
R84  Resistance: 0  [R0603]
R85  Resistance: 470R  [R0603]
R86  Resistance: 51R  [R0402]
R87  Resistance: 51R  [R0402]
R88  Resistance: 10K  [R0603]
R90  Resistance: 4K7  [R0603]
R91  Resistance: 10K  [R0603]
R94  Resistance: 470R  [R0603]
SW6  SWITCH_GEN_4P  [SW_4x4x1.5]  (value not drawn)
SW7  SWITCH_GEN_4P  [SW_4x4x1.5]  (value not drawn)
SW8  SWITCH_GEN_2P  [SW_TACTM-35N-F]  (value not drawn)
SW9  SWITCH_GEN_2P  [SW_TACTM-35N-F]  (value not drawn)
TP25  TEST_POINT  [TP_1mm]  (value not drawn)  (no BOM)
U17  STM32L476VGT  [LQFP100_0.5]  (parts A,B of 2)
U18  74HC2G14  [SOT363/SOT65P210X110-6N]  (parts A,B,C of 3)
U19  USBLC6-2  [SOT-666]
Y1  Q_8MHz  [QSMD12.3x4.5x4.2]
Y2  Q_32.768KHz  [HC_3.0x8.0]

### Ports
3V3, BOOT0, CHG_EN, CHG_STAT, E_CLK, E_EN, E_INTI, E_INTO, E_MISO, E_MOSI, E_RX, E_TX, GND, GPS_RX1, GPS_RX2, GPS_STS, GPS_TX1, GPS_TX2, GPS_TX3, LIS_DRDY, LIS_INT, LSM_INT, LSM_INT2, M24W_~{WC}, PD_ALERT, PD_NSS (bidir), PD_RESET, PD_SCL, PD_SDA, PD_SPI_MISO (bidir), PD_SPI_SCK (bidir), PD_SuperSpeedMux, PD_TX_EN (bidir), PS_SPI_MOSI (bidir), RF1_D0, RF1_D1, RF1_D2, RF1_D3, RF1_D4, RF1_D5, RF1_NSS, RF1_RST, RF2_D0, RF2_D1, RF2_D2, RF2_D3, RF2_D4, RF2_D5, RF2_NSS, RF2_RST, RF_SPI_MISO, RF_SPI_MOSI, RF_SPI_SCK, SCL, SDA, SHT_ALRT, SHT_RST, UB_CLK, UB_D_SEL, UB_EXTI, UB_LNA_EN, UB_MISO, UB_MOSI, UB_RX, UB_SCL, UB_SDA, UB_T_PLS, UB_TX, UB_~{CS}, UB_~{RESET}, VBAT

### Nets
3V3: C46.2 C47.2 C48.2 C49.2 C50.2 C51.2 C52.1 C63.2 C64.2 D10.4(P$4) D12.4(P$4) D14.4(P$4) D15.4(P$4) P6.1 P11.2 R54.1 R82.1 R88.2 R90.1 R91.2 SW7.2 SW7.4 U17.11(VDD) U17.28(VDD) U17.50(VDD) U17.75(VDD) U17.100(VDD) U18.5(VCC) U19.5(VBUS) ; port 3V3
GND: C46.1 C47.1 C48.1 C49.1 C50.1 C51.1 C56.2 C57.1 C58.1 C59.2 C60.1 C61.1 C62.2 C63.1 C64.1 D10.1(P$1) D12.1(P$1) D14.1(P$1) D15.1(P$1) P6.4 P7.3(GND) P8.5(GND) P8.7(GND) P8.11(GNDDetect) P9.5(GND) R19.2 R84.1 R85.1 R94.2 SW6.1 SW6.3 SW8.1 SW9.1 U17.10(VSS) U17.27(VSS) U17.49(VSS) U17.74(VSS) U17.99(VSS) U18.2(GND) U19.2(GND) Y2.PAD ; port GND
STAGND: C53.1 C54.1 C55.1 R84.2 U17.19(VSSA) U17.20(VREF-)
STAVCC: C53.2 C54.2 C55.2 R82.2 U17.21(VREF+) U17.22(VDDA)
3V3j: P8.3(VCC) P11.1
BOOT0: C56.1 D10.3(P$3) R85.2 SW7.1 SW7.3 U17.94(BOOT0) ; port BOOT0
CHG_ENr: U17.51(PB12/I2C2_SMBA/LPUART1_DE/SPI2_NSS) ; port CHG_EN
CHG_STATr: U17.61(PD14) ; port CHG_STAT
E_CLK: U17.78(PC10/SPI3_SCK/UART4_TX/USART3_TX) ; port E_CLK
E_EN: U17.59(PD12) ; port E_EN
E_INTI: U17.87(PD6/USART2_RX) ; port E_INTI
E_INTO: U17.86(PD5/USART2_TX) ; port E_INTO
E_MISO: U17.79(PC11/SPI3_MISO/UART4_RX/USART3_RX) ; port E_MISO
E_MOSI: U17.91(PB5/I2C1_SMBA/SPI1_MOSI/SPI3_MOSI) ; port E_MOSI
E_RX: U17.48(PB11/I2C2_SDA/LPUART1_TX/QUADSPI_NCS/USART3_RX) ; port E_RX
E_TX: U17.47(PB10/I2C2_SCL/LPUART1_RX/QUADSPI_CLK/SPI2_SCK/USART3_TX) ; port E_TX
EVf1: C59.1 D12.2(P$2) R88.1 SW8.2 U18.3(2A)
EVf2: C62.1 D12.3(P$3) R91.1 SW9.2 U18.1(1A)
GPS_TX3: U17.34(PC5/SYS_WKUP5/USART3_RX) ; port GPS_TX3
GPS_VBAT: U17.6(VBAT) ; port VBAT
JCLK: P8.6(JCLK/SWCLK) P12.2 U17.76(PA14_(JTCK-SWCLK))
JCLKj: P8.9(JRCLK/NC) P12.1
JNRST: P8.12(NRST) U17.90(PB4_(NJTRST)/SPI1_MISO/SPI3_MISO)
JTDI: P8.10(JTDI/NC) U17.77(PA15_(JTDI)/SPI1_NSS/SPI3_NSS)
JTDO: P8.8(JTDO/SWO) U17.89(PB3_(JTDO-TRACESWO)/SPI1_SCK/SPI3_SCK)
JTMS: P8.4(JTMS/SWDIO) U17.72(PA13_(JTMS-SWDIO)/USB_OTG_FS_NOE)
LIS_INT: U17.85(PD4/SPI2_MOSI) ; port LIS_INT
M24W_WC: U17.88(PD7) ; port M24W_~{WC}
NRST: R83.1 U17.14(NRST)
PD_ALERT: U17.81(PD0/SPI2_NSS) ; port PD_ALERT
PD_RESET: U17.57(PD10) ; port PD_RESET
PD_SSMUX: U17.60(PD13) ; port PD_SuperSpeedMux
PD_TX_EN: U17.35(PB0/QUADSPI_BK1_IO1) ; port PD_TX_EN
PDI2C_SCL: U17.92(PB6/I2C1_SCL/USART1_TX) ; port PD_SCL
PDI2C_SDA: U17.93(PB7/I2C1_SDA/SYS_PVD_IN/USART1_RX) ; port PD_SDA
PDSPI_MISO: U17.31(PA6/QUADSPI_BK1_IO3/SPI1_MISO) ; port UB_MISO, port PD_SPI_MISO
PDSPI_MOSI: U17.32(PA7/QUADSPI_BK1_IO2/SPI1_MOSI) ; port PS_SPI_MOSI, port UB_MOSI
PDSPI_NSS: U17.29(PA4/SPI1_NSS/SPI3_NSS/USART2_CK) ; port PD_NSS
PDSPI_SCK: U17.30(PA5/SPI1_SCK) ; port PD_SPI_SCK, port UB_CLK
RF1_D0: U17.1(PE2/SYS_TRACECLK) ; port RF1_D0
RF1_D1: U17.2(PE3/SYS_TRACED0) ; port RF1_D1
RF1_D2: U17.3(PE4/SYS_TRACED1) ; port RF1_D2
RF1_D3: U17.65(PC8) ; port RF1_D3
RF1_D4: U17.66(PC9/USB_OTG_FS_NOE) ; port RF1_D4
RF1_D5: U17.67(PA8/RCC_MCO/USB_OTG_FS_SOF) ; port RF1_D5
RF1_NSS: U17.45(PE14/QUADSPI_BK1_IO2/SPI1_MISO) ; port RF1_NSS
RF1_RST: U17.46(PE15/QUADSPI_BK1_IO3/SPI1_MOSI) ; port RF1_RST
RF2_D0: U17.4(PE5/SYS_TRACED2) ; port RF2_D0
RF2_D1: U17.56(PD9/USART3_RX) ; port RF2_D1
RF2_D2: U17.55(PD8/USART3_TX) ; port RF2_D2
RF2_D3: U17.54(PB15/SPI2_MOSI) ; port RF2_D3
RF2_D4: U17.96(PB9/I2C1_SDA/SPI2_NSS) ; port RF2_D4
RF2_D5: U17.95(PB8/I2C1_SCL) ; port RF2_D5
RF2NSS: U17.43(PE12/QUADSPI_BK1_IO0/SPI1_NSS) ; port RF2_NSS
RF2RST: U17.44(PE13/QUADSPI_BK1_IO1/SPI1_SCK) ; port RF2_RST
RF_MISO: U17.17(PC2/SPI2_MISO) ; port RF_SPI_MISO
RF_MOSI: U17.18(PC3/SPI2_MOSI) ; port RF_SPI_MOSI
RF_SCK: U17.82(PD1/SPI2_SCK) ; port RF_SPI_SCK
SCL: D15.3(P$3) P6.2 R54.2 U17.52(PB13/I2C2_SCL/SPI2_SCK) ; port SCL
SDA: D15.2(P$2) P6.3 R90.2 U17.53(PB14/I2C2_SDA/SPI2_MISO/USART3_DE) ; port SDA
SHT_ALERT: U17.37(PB2/I2C3_SMBA) ; port SHT_ALRT
SHT_RST: U17.36(PB1/QUADSPI_BK1_IO0) ; port SHT_RST
ST_D0_N: R86.2 U19.1(I/O1)
ST_D0_P: R87.2 U19.3(I/O2)
ST_D1_N: P9.2(DATA-) U19.6(I/O1)
ST_D1_P: P9.3(DATA+) U19.4(I/O2)
ST_D_N: R86.1 U17.70(PA11/USART1_CTS/USB_OTG_FS_DM)
ST_D_P: R87.1 U17.71(PA12/USB_OTG_FS_DP)
STLED1: D11.A U17.64(PC7)
STLED2: D13.A U17.58(PD11)
STUEV1: U17.5(PE6/SYS_TRACED3/SYS_WKUP3) U18.4(2Y)
STUEV2: U17.7(PC13/SYS_WKUP2) U18.6(1Y)
SVBUSa: P9.1(VCC) P13.1
SVBUSb: P13.2 U17.73(VDDUSB)
UB_~{CS}: U17.42(PE11/QUADSPI_NCS) ; port UB_~{CS}
UB_EXTI: U17.38(PE7) ; port UB_EXTI
UB_LNA_EN: U17.63(PC6) ; port UB_LNA_EN
UB_~{RST}: U17.40(PE9) ; port UB_~{RESET}
UB_RX: U17.23(PA0/SYS_WKUP1/UART4_TX) ; port UB_RX
UB_SCL: U17.15(PC0/I2C3_SCL/LPUART1_RX) ; port UB_SCL
UB_SDA: U17.16(PC1/I2C3_SDA/LPUART1_TX) ; port UB_SDA
UB_TPULS: U17.39(PE8) ; port UB_T_PLS
UB_TX: U17.24(PA1/UART4_RX) ; port UB_TX
VCPRX: D14.3(P$3) P7.1(RX) P8.13(VCP_RX) U17.83(PD2/UART5_RX)
VCPTX: D14.2(P$2) P7.2(TX) P8.14(VCP_TX) U17.80(PC12/SPI3_MOSI/UART5_TX)
Y8A: C57.2 U17.13(PH1-OSC_OUT_(PH1)/RCC_OSC_OUT) Y1.1
Y8B: C58.2 U17.12(PH0-OSC_IN_(PH0)/RCC_OSC_IN) Y1.2
Y32A: C60.2 U17.9(PC15-OSC32_OUT_(PC15)/RCC_OSC32_OUT) Y2.1
Y32B: C61.2 U17.8(PC14-OSC32_IN_(PC14)/RCC_OSC32_IN) Y2.2
NetC52_2: C52.2 D10.2(P$2) R83.2 SW6.2 SW6.4
NetCFG7_1: U17.97(PE0) ; port LSM_INT2
NetD11_C: D11.C R19.1
NetD13_C: D13.C R94.1
NetJ2_2: U17.25(PA2/RCC_LSCO/SYS_WKUP4/USART2_TX) ; port GPS_RX2
NetJ3_2: U17.26(PA3/USART2_RX) ; port GPS_TX2
NetJ4_2: U17.69(PA10/USART1_RX/USB_OTG_FS_ID) ; port GPS_TX1
NetJ5_2: U17.68(PA9/USART1_TX/USB_OTG_FS_VBUS) ; port GPS_RX1
NetP9_4: P9.4(ID) TP25.1
NetR12_1: U17.62(PD15) ; port GPS_STS
NetR21_1: U17.41(PE10/QUADSPI_CLK) ; port UB_D_SEL
NetR23_1: U17.84(PD3/SPI2_MISO) ; port LIS_DRDY
NetU8_4: U17.98(PE1) ; port LSM_INT

Not connected (* = marked no-connect by the designer): P8 1(Reserved)* 2(Reserved)*; U17 33(PC4/USART3_TX)*

### Layout directives
differential pair; net class USB: ST_D0_N, ST_D0_P, ST_D1_N, ST_D1_P, ST_D_N, ST_D_P
net class POWER_NET_CLASS: 3V3, GND, STAGND, STAVCC, SVBUSa, SVBUSb
differential pair: ST_D_N, ST_D_P

### Notes on the sheet
- (near U17) STM32
- (near R88) ST U EVENT 1
- (near R91) ST U EVENT 2

### Library data of the parts
C46-C51 C54 = C0603_100nF_16V: Ceramic capacitor; Voltage: 16V; Capacity: 100nF; Size: 0603; Value: 100nF; PriceKosmodromUAH: 1; Kosmodrom: http://www.kosmodrom.com.ua/el.php?name=CP06030.125V8020
C52 C56 C59 C62 = C0603_1nF_25V: Ceramic capacitor; Voltage: 25V; Capacity: 1nF; Size: 0603; Value: 1nF; PriceKosmodromUAH: 0,75; Kosmodrom: http://www.kosmodrom.com.ua/el.php?name=CP0603100050V10
C53 C63 C64 = C0805_1uF_25V: Ceramic capacitor; Voltage: 25V; Capacity: 1uF; Size: 0805; Value: 1uF; PriceKosmodromUAH: 1; Kosmodrom: http://www.kosmodrom.com.ua/el.php?name=CP0805125V10
C55 = C0603_10nF_16V: Ceramic capacitor; Voltage: 16V; Capacity: 10nF; Size: 0603; Value: 10nF; PriceKosmodromUAH: 0,25; Kosmodrom: http://www.kosmodrom.com.ua/el.php?name=CP06031050V10
C57 C58 = C0603_20pF_50V: Ceramic capacitor; Voltage: 25V; Capacity: 20pF; Size: 0603; Value: 20pF; PriceKosmodromUAH: 0,25; Kosmodrom: http://www.kosmodrom.com.ua/el.php?name=CP06032050V5
C60 C61 = C0603_4.3pF_50V: Ceramic capacitor; Voltage: 25V; Capacity: 4.3pF; Size: 0603; Value: 4.3pF; PriceKosmodromUAH: 0,25; Kosmodrom: http://www.kosmodrom.com.ua/el.php?name=CP06034.350V0.25
D10 D12 D14 D15 = PRTR5V0U2X,215: as D16 on sheet 02-ESP32; Package: SOT-143 Nexperia; Price: None; Availability: Unavailable; MP: PRTR5V0U2X,215; SnapEDA_Link: https://www.snapeda.com/parts/PRTR5V0U2X%2C215/Nexperia%20USA%20Inc./view-part/?ref=snap; Value: *; PriceKosmodromUAH: 3,25; Kosmodrom: http://www.kosmodrom.com.ua/el.php?name=PRTR5V0U2X.215
D11 D13 = LED: as D9 on sheet 02-ESP32; SnapEDA_Link: https://www.snapeda.com/parts/598-8140-107F/Dialight/view-part/?ref=snap; Price: None; Availability: Unavailable; Package: 0805 Dialight; Value: *
P8 = BH-14_JTAG_STLINK: 1,27 mm 2x7 Header; Owned: 10; PriceKosmodromUAH: 7,75; Kosmodrom: http://www.kosmodrom.com.ua/el.php?name=BH1.27-14
P9 = CON-USB-Micro/Mini: Mini/Micro USB B Type RCPT; MF: TE Connectivity; Availability: Unavailable; Package: None; MP: 440247-2; SnapEDA_Link: https://www.snapeda.com/parts/440247-2/TE%20Connectivity%20AMP%20Connectors/view-part/?ref=snap; TE_purchase_URL: https://www.te.com/usa-en/product-440247-2.html?te_bu=Cor&te_type=disp&te_campaign=seda_glo_cor-seda-global-disp-prtnr-fy19-seda-model-bom-cta_sma-317_1&elqCampaignId=32493; Price: None; Value: *; PriceKosmodromUAH: 2,5; Kosmodrom: http://www.kosmodrom.com.ua/el.php?name=ESB228110100Z
R19 R85 R94 = R0603_470R: as R72 on sheet 02-ESP32; Size: 0603
R54 R90 = R0603_4K7: Resistor General; Tolerance: 5%; Owned: 3000; Size: 0603
R82 R84 = R0603_0R: Resistor General; Tolerance: *; Size: 0603; PriceRCSUAH: 0,06; RCS: https://www.rcscomponents.kiev.ua/product/0-ohm-5-0-1w-50v-0603-rc0603jr-0r-hitano-rezistor-smd_4159.html
R83 R86 R87 = R0402_51R: Resistor General; Tolerance: *; Size: 0402; PriceKosmodromUAH: 0,03; PriceRCSUAH: 0,05; Kosmodrom: http://www.kosmodrom.com.ua/el.php?name=0402SMDRES51OM5; RCS: https://www.rcscomponents.kiev.ua/product/51-ohm-5-1-16w-50v-0402-rc0402jr-51r-hitano_11504.html
R88 R91 = R0603_10K: as R73 on sheet 02-ESP32; Size: 0603; PriceRCSUAH: 0,06; RCS: https://www.rcscomponents.kiev.ua/product/10-kohm-5-0-1w-50v-0603-rc0603jr-0710kl-yageo_107096.html
SW6 SW7 = SWITCH_GEN_4P: SWITCH DIP 4.3 mm; PriceKosmodromUAH: 0,5; Kosmodrom: http://www.kosmodrom.com.ua/el.php?name=TACT-5X5X1.5
SW8 SW9 = SWITCH_GEN_2P: SWITCH DIP 4.3 mm; PriceKosmodromUAH: 1,25; Kosmodrom: http://www.kosmodrom.com.ua/el.php?name=TACT-35N-F
U17 = STM32L476VGT: Ultra-low-power Cortex-M4 32-bit MCU+FPU, 100DMIPS, up to 1MB Flash, 128 KB SRAM, USB OTG FS, LCD; Owned: 6; PriceUAH: 253,84; OtherUA: https://step-elektronika.prom.ua/p499466797-mikrokontroller-shirokogo-naznacheniya.html
U18 = 74HC2G14: Dual inverting Schmitt trigger; PriceKosmodromUAH: 4,5; Kosmodrom: http://www.kosmodrom.com.ua/el.php?name=74HC2G14GW.125
U19 = USBLC6-2: Very low capacitance ESD protection; PriceKosmodromUAH: 4,25; Kosmodrom: http://www.kosmodrom.com.ua/el.php?name=USBLC6-2P6
Y1 = Q_8MHz: Quartz resonator 8MHz; PriceKosmodromUAH: 6; Kosmodrom: http://www.kosmodrom.com.ua/el.php?name=KX-K-8.0-MHz
Y2 = Q_32.768KHz: Quartz resonator 32.768KHz; PriceKosmodromUAH: 5; Kosmodrom: http://www.kosmodrom.com.ua/el.php?name=KX-38T-32.768-kHz-6pF

## Sheet 07-POWER.SchDoc
size A4; DocumentNumber: 7; SheetNumber: 7; SheetTotal: 8
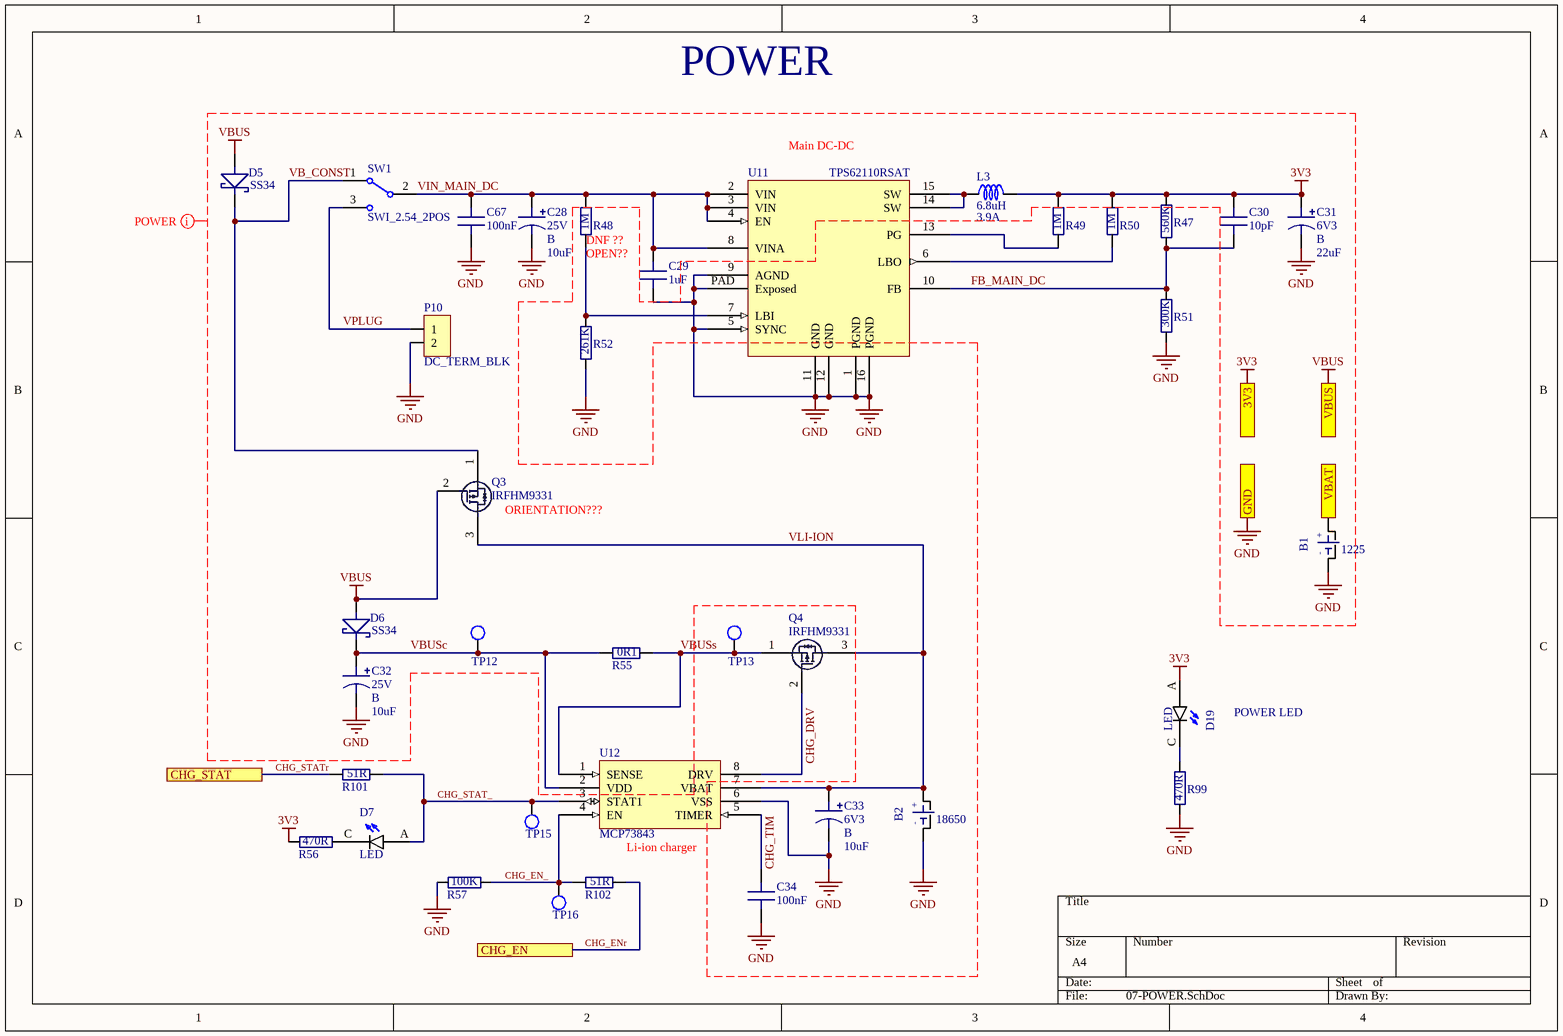
[diagram p4: 07-POWER.SchDoc]

### Parts
B1  Size: 1225  [BH500-CR1216/20/25-COMB]  (hidden comment: CR12XX_BH500)
B2  Size: 18650  [18650-COMBI]  (hidden comment: 18650_KEYS1042_HOLDER)
C28  Voltage: 25V  Size: B  [CAP_SIZE_B]  (hidden comment: 10uF)
C29  1uF  [C0805]
C30  10pF  [C0603]
C31  Voltage: 6V3  Size: B  [CAP_SIZE_B]  (hidden comment: 22uF)
C32  Voltage: 25V  Size: B  [CAP_SIZE_B]  (hidden comment: 10uF)
C33  Voltage: 6V3  Size: B  [CAP_SIZE_B]  (hidden comment: 10uF)
C34  100nF  [C0805]
C67  100nF  [C0805]
D5  Name: SS34  [DO-214AC]  (hidden comment: SMD-DIODE-SCHOTTKY-40V-3A(DO-214AB))
D6  Name: SS34  [DO-214AC]  (hidden comment: SMD-DIODE-SCHOTTKY-40V-3A(DO-214AB))
D7  LED  [LED_0604]
D19  LED  [LED_0604]
L3  Current: 3.9A  Inductivity: 6.8uH  [L_CDRH8D43]  (hidden comment: *)
P10  DC_TERM_BLK  [TERM_BLK_2.54]
Q3  IRFHM9331  [PQFN-3x3]
Q4  IRFHM9331  [PQFN-3x3]
R47  Resistance: 560K  [R0805]
R48  Resistance: 1M  [R0805]
R49  Resistance: 1M  [R0805]
R50  Resistance: 1M  [R0805]
R51  Resistance: 300K  [R0805]
R52  Resistance: 261K  [R0805]
R55  Resistance: 0R1  [R2512]
R56  Resistance: 470R  [R0603]
R57  Resistance: 100K  [R0603]
R99  Resistance: 470R  [R0603]
R101  Resistance: 51R  [R0402]
R102  Resistance: 51R  [R0402]
SW1  SWI_2.54_2POS  [SW_1x3 2.54]
TP12  TEST_POINT  [TP_1mm]  (value not drawn)
TP13  TEST_POINT  [TP_1mm]  (value not drawn)
TP15  TEST_POINT  [TP_1mm]  (value not drawn)
TP16  TEST_POINT  [TP_1mm]  (value not drawn)
U11  TPS62110RSAT  [VQFN-16]
U12  MCP73843  [MSOP-8-SOP65P490X110-8N]

### Ports
3V3 (out), CHG_EN, CHG_STAT, GND, VBAT (out), VBUS (out)

### Nets
3V3: C30.1 C31.1 D19.A L3.2 R47.2 R49.2 R50.2 R56.1 ; port 3V3
GND: B1.NEG B2.NEG C28.2 C29.1 C31.2 C32.2 C33.2 C34.1 C67.1 P10.2 R51.1 R52.1 R57.1 R99.1 U11.1(PGND) U11.5(SYNC) U11.9(AGND) U11.11(GND) U11.12(GND) U11.16(PGND) U11.PAD(Exposed) U12.6(VSS) ; port GND
VBUS: D5.A(POS) D6.A(POS) Q3.2(G) ; port VBUS
CHG_DRV: Q4.2(G) U12.8(DRV)
CHG_EN_: R57.2 R102.1 TP16.1 U12.4(EN)
CHG_ENr: R102.2 ; port CHG_EN
CHG_STAT_: D7.A R101.2 TP15.1 U12.3(STAT1)
CHG_STATr: R101.1 ; port CHG_STAT
CHG_TIM: C34.2 U12.5(TIMER)
FB_MAIN_DC: C30.2 R47.1 R51.2 U11.10(FB)
GPS_VBAT: B1.POS ; port VBAT
VB_CONST: D5.C(NEG) Q3.1(S) SW1.1
VBUSc: C32.1 D6.C(NEG) R55.1 TP12.1 U12.2(VDD)
VBUSs: Q4.1(S) R55.2 TP13.1 U12.1(SENSE)
VIN_MAIN_DC: C28.1 C29.2 C67.2 R48.2 SW1.2 U11.2(VIN) U11.3(VIN) U11.4(EN) U11.8(VINA)
VLI-ION: B2.POS C33.1 Q3.3(D) Q4.3(D) U12.7(VBAT)
VPLUG: P10.1 SW1.3
NetD7_C: D7.C R56.2
NetD19_C: D19.C R99.2
NetL3_1: L3.1 U11.14(SW) U11.15(SW)
NetR48_1: R48.1 R52.2 U11.7(LBI)
NetR49_1: R49.1 U11.13(PG)
NetR50_1: R50.1 U11.6(LBO)

### Layout directives
net class POWER_NET_CLASS: 3V3, CHG_TIM, GND, VB_CONST, VBUS, VBUSc, VBUSs, VIN_MAIN_DC, VLI-ION, VPLUG

### Notes on the sheet
- POWER
- (near U11) Main DC-DC
- (near R48) DNF ??
- (near R48) OPEN??
- (near Q3) ORIENTATION???
- POWER LED
- Li-ion charger
- (in symbol 18650_KEYS1042_HOLDER) +; -
- (in symbol CR12XX_BH500) +; -

### Library data of the parts
B1 = CR12XX_BH500: Coin Cell Battery 3V 12 X 2.5 mm 48mA Holder; MP: BR1225; MF: Panasonic Battery; Availability: Unavailable; Price: None; SnapEDA_Link: https://www.snapeda.com/parts/BR1225/Panasonic/view-part/?ref=snap; Package: Panasonic Battery; ComponentLink1Description: Kosmodrom; ComponentLink1URL: http://www.kosmodrom.com.ua/el.php?name=BH500; PriceKosmodromUAH: 8,25
B2 = 18650_KEYS1042_HOLDER: 18650 Li-ion Battery Holder; Price: None; ComponentLink1Description: Kosmodrom; ComponentLink1URL: http://www.kosmodrom.com.ua/el.php?name=KEYS1042; PriceKosmodromUAH: 19,5
C28 C32 = CAP_B_10uF_25V: Tantalum capacitor; Capacity: 10uF; Value: 10uF
C29 = C0805_1uF_25V: Ceramic capacitor; Voltage: 25V; Capacity: 1uF; Size: 0805; Value: 1uF
C30 = C0603_10pF_25V: Ceramic capacitor; Voltage: 25V; Capacity: 10pF; Size: 0603; Value: 10pF
C31 = CAP_B_22uF_6V3: Tantalum capacitor; Capacity: 22uF; Value: 22uF
C33 = CAP_B_10uF_6V3: Tantalum capacitor; Capacity: 10uF; Value: 10uF
C34 C67 = C0805_100nF_25V: Ceramic capacitor; Voltage: 25V; Capacity: 100nF; Size: 0805; Value: 100nF
D5 D6 = D_SS-34: Rectifier, Schottky; DO-214AB; 3.0A IF; 0.75V; 40V; 100A IFRM; 10000V/us; 1000pF; MF: Vishay; MP: SS34-E3/57T; Package: DO-214 Vishay; Price: 0.33 USD; SnapEDA_Link: https://www.snapeda.com/symbols-footprints/SS34-E3/57T/Vishay%20Semiconductor%20Diodes%20Division/view-part/?ref=snap; Availability: Good; Value: *
D7 D19 = LED: as D1 on sheet 01-UART; SnapEDA_Link: https://www.snapeda.com/parts/598-8140-107F/Dialight/view-part/?ref=snap; Price: None; Availability: Unavailable; Package: 0805 Dialight; Value: *
L3 = L_CDHR8D43_6.8uH_3.9A: Inductor Generic; Value: *; Size: CHDR8D43; Url: http://www.kosmodrom.com.ua/el.php?name=CDRH8D43NP-6R8NC
R47 = R0805_560K_1%: Resistor General; Tolerance: 1%; Size: 0805
R48-R50 = R0805_1M_1%: Resistor General; Tolerance: 1%; Size: 0805
R51 = R0805_300K_1%: Resistor General; Tolerance: 1%; Size: 0805
R52 = R0805_261K_1%: Resistor General; Tolerance: 1%; Size: 0805
R55 = R2512_0R1_1%: Resistor General; Tolerance: *; Size: 2512
R56 R99 = R0603_470R: Resistor General; Tolerance: 5%; Size: 0603
R57 = R0603_100K: Resistor General; Tolerance: 5%; Size: 0603
R101 R102 = R0402_51R: Resistor General; Tolerance: *; Size: 0402
SW1 = SWI_2.54_2POS: Generich 2 pos switch
U11 = TPS62110RSAT: TPS6211x 17-V, 1.5-A, Synchronous Step-Down Converter
U12 = MCP73843: MCP73843 Single Li-ion cell charger IC; MF: Microchip; Availability: Unavailable; MP: MCP73843; Price: None; Package: SOIC-8 ON Semiconductor; Value: *

## Sheet 08-TYPE-C-PORT.SchDoc
size A4; DocumentNumber: 8; SheetNumber: 8; SheetTotal: 8
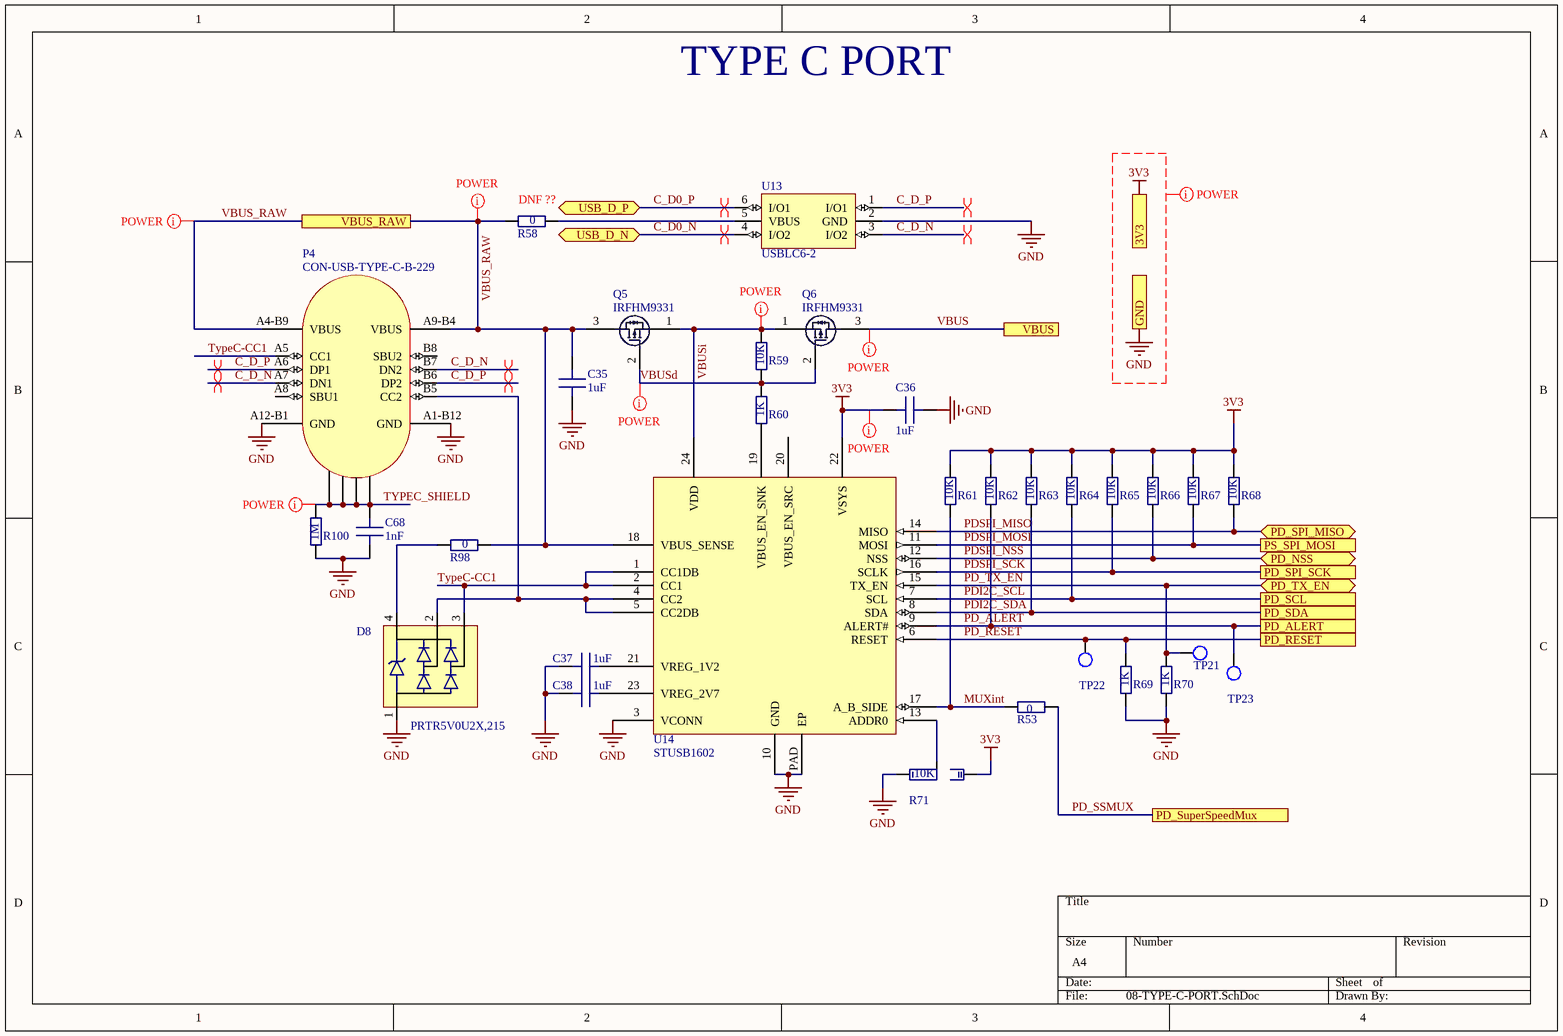
[diagram p5: 08-TYPE-C-PORT.SchDoc]

### Parts
C35  1uF  [C0805]
C36  1uF  [C0805]
C37  1uF  [C0805]
C38  1uF  [C0805]
C68  1nF  [C1206]
D8  PRTR5V0U2X,215  [SOT143B]
P4  CON-USB-TYPE-C-B-229  [USB-Type-C-B-229]
Q5  IRFHM9331  [PQFN-3x3]
Q6  IRFHM9331  [PQFN-3x3]
R53  Resistance: 0  [R0402]
R58  Resistance: 0  [R0402_NOSILK]
R59  Resistance: 10K  [R0603]
R60  Resistance: 1K  [R0603]
R61  Resistance: 10K  [R0603]
R62  Resistance: 10K  [R0603]
R63  Resistance: 10K  [R0603]
R64  Resistance: 10K  [R0603]
R65  Resistance: 10K  [R0603]
R66  Resistance: 10K  [R0603]
R67  Resistance: 10K  [R0603]
R68  Resistance: 10K  [R0603]
R69  Resistance: 1K  [R0603]
R70  Resistance: 1K  [R0603]
R71  Resistance: 10K  [RJ0603]
R98  Resistance: 0  [R0402]
R100  Resistance: 1M  [R2512]
TP21  TEST_POINT  [TP_1mm]  (value not drawn)
TP22  TEST_POINT  [TP_1mm]  (value not drawn)
TP23  TEST_POINT  [TP_1mm]  (value not drawn)
U13  USBLC6-2  [SOT-666]
U14  STUSB1602  [QFN24-4x4x0.9]

### Ports
3V3, GND, PD_ALERT, PD_NSS (bidir), PD_RESET, PD_SCL, PD_SDA, PD_SPI_MISO (bidir), PD_SPI_SCK, PD_SuperSpeedMux, PD_TX_EN (bidir), PS_SPI_MOSI, USB_D_N (bidir), USB_D_P (bidir), VBUS, VBUS_RAW

### Nets
3V3: C36.1 R61.2 R62.2 R63.2 R64.2 R65.2 R66.2 R67.2 R68.2 R71.3 U14.22(VSYS) ; port 3V3
GND: C35.1 C36.2 C37.1 C38.1 C68.1 D8.1(P$1) P4.A1-B12(GND) P4.A12-B1(GND) R69.1 R70.1 R71.1 R100.1 U13.2(GND) U14.3(VCONN) U14.10(GND) U14.PAD(EP) ; port GND
VBUS: Q6.3(D) ; port VBUS
C_D0_N: U13.4(I/O2) ; port USB_D_N
C_D0_P: U13.6(I/O1) ; port USB_D_P
C_D_N: P4.A7(DN1) P4.B7(DN2) U13.3(I/O2)
C_D_P: P4.A6(DP1) P4.B6(DP2) U13.1(I/O1)
MUXint: R53.2 R61.1 U14.17(A_B_SIDE)
PD_ALERT: R62.1 TP23.1 U14.9(ALERT#) ; port PD_ALERT
PD_RESET: R69.2 TP22.1 U14.6(RESET) ; port PD_RESET
PD_SSMUX: R53.1 ; port PD_SuperSpeedMux
PD_TX_EN: R70.2 TP21.1 U14.15(TX_EN) ; port PD_TX_EN
PDI2C_SCL: R64.1 U14.7(SCL) ; port PD_SCL
PDI2C_SDA: R63.1 U14.8(SDA) ; port PD_SDA
PDSPI_MISO: R68.1 U14.14(MISO) ; port PD_SPI_MISO
PDSPI_MOSI: R67.1 U14.11(MOSI) ; port PS_SPI_MOSI
PDSPI_NSS: R66.1 U14.12(NSS) ; port PD_NSS
PDSPI_SCK: R65.1 U14.16(SCLK) ; port PD_SPI_SCK
TypeC-CC1: D8.3(P$3) P4.A5(CC1) U14.1(CC1DB) U14.2(CC1)
TYPEC_SHIELD: C68.2 P4.SHIELD R100.2
VBUS_RAW: C35.2 P4.A4-B9(VBUS) P4.A9-B4(VBUS) Q5.3(D) R58.1 R98.2 U14.18(VBUS_SENSE) ; port VBUS_RAW
VBUSd: Q5.2(G) Q6.2(G) R59.1 R60.2
VBUSi: Q5.1(S) Q6.1(S) R59.2 U14.24(VDD)
NetC37_2: C37.2 U14.21(VREG_1V2)
NetC38_2: C38.2 U14.23(VREG_2V7)
NetD8_2: D8.2(P$2) P4.B5(CC2) U14.4(CC2) U14.5(CC2DB)
NetD8_4: D8.4(P$4) R98.1
NetR58_2: R58.2 U13.5(VBUS)
NetR60_1: R60.1 U14.19(VBUS_EN_SNK)
NetR71_2: R71.2 U14.13(ADDR0)

Not connected (* = marked no-connect by the designer): P4 A8(SBU1) B8(SBU2); U14 20(VBUS_EN_SRC)

### Layout directives
differential pair; net class USB: C_D0_N, C_D0_P, C_D_N, C_D_P
net class POWER_NET_CLASS: 3V3, GND, TYPEC_SHIELD, VBUS, VBUS_RAW, VBUSd, VBUSi

### Notes on the sheet
- TYPE C PORT
- (near R58) DNF ??

### Library data of the parts
C35-C38 = C0805_1uF_25V: Ceramic capacitor; Voltage: 25V; Capacity: 1uF; Size: 0805; Value: 1uF
C68 = C1206_1nF_2KV: Ceramic capacitor; Voltage: 2KV; Capacity: 1nF; Size: 1206; Value: 1nF
D8 = PRTR5V0U2X,215: PRTR5V0U2X - Ultra low capacitance double rail-to-rail ESD protection diode; MF: Nexperia USA; Package: SOT-143 Nexperia; Price: None; Availability: Unavailable; MP: PRTR5V0U2X,215; SnapEDA_Link: https://www.snapeda.com/parts/PRTR5V0U2X%2C215/Nexperia%20USA%20Inc./view-part/?ref=snap; Value: *
R53 R58 R98 = R0402_0R: Resistor General; Tolerance: *; Size: 0402
R59 = R0603_10K_1%: Resistor General; Tolerance: 1%; Size: 0603
R60 = R0603_1K_1%: Resistor General; Tolerance: 1%; Size: 0603
R61-R68 = R0603_10K: Resistor General; Tolerance: 5%; Size: 0603
R69 R70 = R0603_1K: Resistor General; Tolerance: 5%; Size: 0603
R71 = RJ0603_10K: Resistor General; Tolerance: 5%; Size: 0603
R100 = R2512_1M_5%: Resistor General; Tolerance: 5%; Size: 2512
U13 = USBLC6-2: Very low capacitance ESD protection
U14 = STUSB1602: USB Type-C controller with TX/RX line driver and BMC

## Sheet 03-GPS.SchDoc
size A4
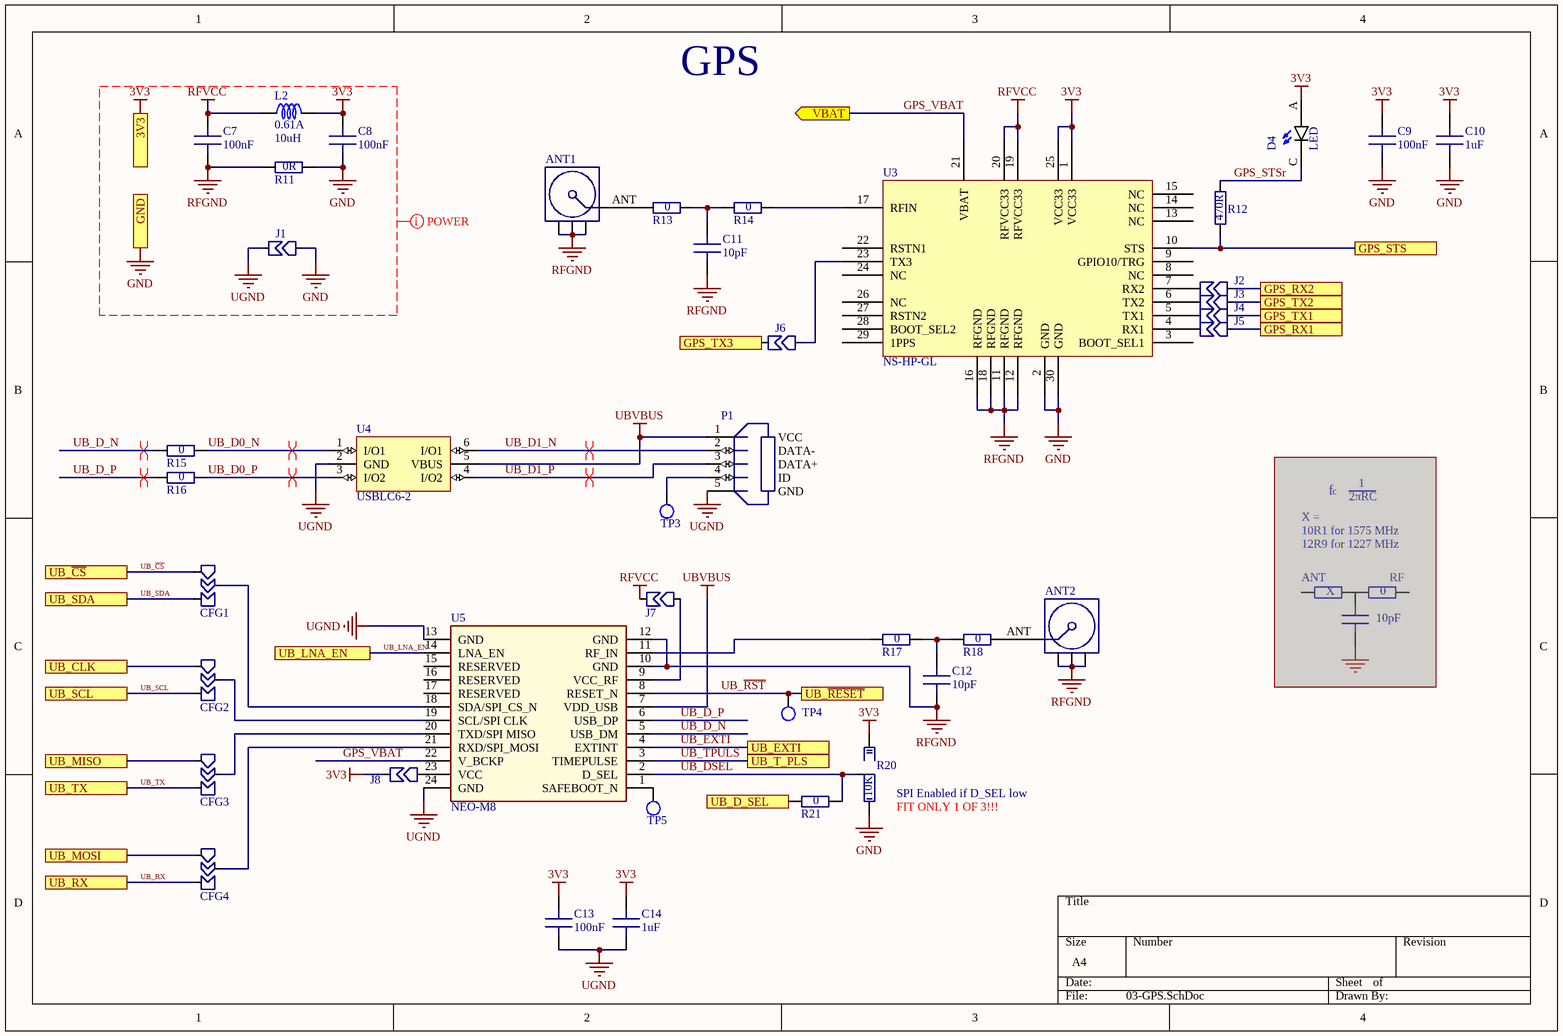
[diagram p6: 03-GPS.SchDoc]

### Parts
(Parts that share a designator on the sheet are numbered #1, #2 ... from top to bottom, then left to right.)
ANT1  UFL  [U.FL CONNECTOR]  (value not drawn)
ANT2  UFL  [U.FL CONNECTOR]  (value not drawn)
C7  100nF  [C0603_NOSILK]
C8  100nF  [C0603_NOSILK]
C9  100nF  [C0603]
C10  1uF  [C0805]
C11  10pF  [C0402]
C12  10pF  [C0402]
C13  100nF  [C0603]
C14  1uF  [C0805]
C_F  10pF  [C0402]  (masked out: inside a compile mask, not in the netlist)
CFG1  CFG3_ORTH  [CFG_0603]  (value not drawn)
CFG2  CFG3_ORTH  [CFG_0603]  (value not drawn)
CFG3  CFG3_ORTH  [CFG_0603]  (value not drawn)
CFG4  CFG3_ORTH  [CFG_0603]  (value not drawn)
D4  LED  [LED_0604]
J1  CFG2  [CFG_J_0603]  (value not drawn)
J2  CFG2  [CFG_J_0603]  (value not drawn)
J3  CFG2  [CFG_J_0603]  (value not drawn)
J4  CFG2  [CFG_J_0603]  (value not drawn)
J5  CFG2  [CFG_J_0603]  (value not drawn)
J6  CFG2  [CFG_J_0603]  (value not drawn)
J7  CFG2  [CFG_J_0603]  (value not drawn)
J8  CFG2  [CFG_J_0603]  (value not drawn)
L2  Current: 0.61A  Inductivity: 10uH  [L_CDRH4D18]  (hidden comment: *)
P1  440247-2  [CON-UUSB-F-2]  (value not drawn)
R11  Resistance: 0R  [R0805]
R12  Resistance: 470R  [R0603]
R13  Resistance: 0  [R0402]
R14  Resistance: 0  [R0402]
R15  Resistance: 0  [R0402]
R16  Resistance: 0  [R0402]
R17  Resistance: 0  [R0402]
R18  Resistance: 0  [R0402]
R20  Resistance: 10K  [RJ0603]
R21  Resistance: 0  [R0603]
R?#1  Resistance: X  [R0402]  (masked out: inside a compile mask, not in the netlist)
R?#2  Resistance: 0  [R0402]  (masked out: inside a compile mask, not in the netlist)
TP3  TEST_POINT  [TP_1mm]  (value not drawn)
TP4  TEST_POINT  [TP_1mm]  (value not drawn)
TP5  TEST_POINT  [TP_1mm]  (value not drawn)
U3  NS-HP-GL  [SKYTRAQ-MOD-COMB]
U4  USBLC6-2  [SOT-666]
U5  NEO-M8  [NEO]

### Ports
3V3 (out), GND, GPS_RX1, GPS_RX2, GPS_STS, GPS_TX1, GPS_TX2, GPS_TX3, UB_CLK, UB_D_SEL, UB_EXTI, UB_LNA_EN, UB_MISO, UB_MOSI, UB_RX, UB_SCL, UB_SDA, UB_T_PLS, UB_TX, UB_~{CS}, UB_~{RESET}, VBAT (out)

### Nets
3V3: C8.2 C9.2 C10.2 C13.2 C14.2 D4.A J8.1(A) L2.2 R20.3 U3.1(VCC33) U3.25(VCC33) ; port 3V3
GND: C8.1 C9.1 C10.1 J1.2(IN) R11.2 R20.1 U3.2(GND) U3.30(GND) ; port GND
RFGND: ANT1.GND ANT2.GND C7.1 C11.1 C12.1 R11.1 U3.11(RFGND) U3.12(RFGND) U3.16(RFGND) U3.18(RFGND) U5.10(GND) U5.12(GND)
RFVCC: C7.2 J7.1(A) L2.1 U3.19(RFVCC33) U3.20(RFVCC33)
UBVBUS: P1.1(VCC) U4.5(VBUS) U5.7(VDD_USB)
UGND: C13.1 C14.1 J1.1(A) P1.5(GND) U4.2(GND) U5.13(GND) U5.24(GND)
GPS_STSr: D4.C R12.2
GPS_TX3: J6.1(A) ; port GPS_TX3
GPS_VBAT: U3.21(VBAT) U5.22(V_BCKP) ; port VBAT
PDSPI_MISO: CFG3.3(B) ; port UB_MISO
PDSPI_MOSI: CFG4.3(B) ; port UB_MOSI
PDSPI_SCK: CFG2.3(B) ; port UB_CLK
UB_~{CS}: CFG1.3(B) ; port UB_~{CS}
UB_D0_N: R15.2 U4.1(I/O1)
UB_D0_P: R16.2 U4.3(I/O2)
UB_D1_N: P1.2(DATA-) U4.6(I/O1)
UB_D1_P: P1.3(DATA+) U4.4(I/O2)
UB_D_N: R15.1 U5.5(USB_DM)
UB_D_P: R16.1 U5.6(USB_DP)
UB_DSEL: R20.2 R21.2 U5.2(D_SEL)
UB_EXTI: U5.4(EXTINT) ; port UB_EXTI
UB_LNA_EN: U5.14(LNA_EN) ; port UB_LNA_EN
UB_~{RST}: TP4.1 U5.8(RESET_N) ; port UB_~{RESET}
UB_RX: CFG4.1(A) ; port UB_RX
UB_SCL: CFG2.1(A) ; port UB_SCL
UB_SDA: CFG1.1(A) ; port UB_SDA
UB_TPULS: U5.3(TIMEPULSE) ; port UB_T_PLS
UB_TX: CFG3.1(A) ; port UB_TX
NetANT1_ANT: ANT1.ANT(SIGNAL) R13.1
NetANT2_ANT: ANT2.ANT(SIGNAL) R18.2
NetC11_2: C11.2 R13.2 R14.1
NetC12_2: C12.2 R17.2 R18.1
NetCFG1_2: CFG1.2(IN) U5.18(SDA/SPI_CS_N)
NetCFG2_2: CFG2.2(IN) U5.19(SCL/SPI_CLK)
NetCFG3_2: CFG3.2(IN) U5.20(TXD/SPI_MISO)
NetCFG4_2: CFG4.2(IN) U5.21(RXD/SPI_MOSI)
NetJ2_1: J2.1(A) U3.7(RX2)
NetJ2_2: J2.2(IN) ; port GPS_RX2
NetJ3_1: J3.1(A) U3.6(TX2)
NetJ3_2: J3.2(IN) ; port GPS_TX2
NetJ4_1: J4.1(A) U3.5(TX1)
NetJ4_2: J4.2(IN) ; port GPS_TX1
NetJ5_1: J5.1(A) U3.4(RX1)
NetJ5_2: J5.2(IN) ; port GPS_RX1
NetJ6_2: J6.2(IN) U3.23(TX3)
NetJ7_2: J7.2(IN) U5.9(VCC_RF)
NetJ8_2: J8.2(IN) U5.23(VCC)
NetP1_4: P1.4(ID) TP3.1
NetR12_1: R12.1 U3.10(STS) ; port GPS_STS
NetR14_2: R14.2 U3.17(RFIN)
NetR17_1: R17.1 U5.11(RF_IN)
NetR21_1: R21.1 ; port UB_D_SEL
NetTP5_1: TP5.1 U5.1(SAFEBOOT_N)

Not connected (* = marked no-connect by the designer): U3 3(BOOT_SEL1) 8(NC) 9(GPIO10/TRG) 13(NC) 14(NC) 15(NC) 22(RSTN1) 24(NC) 26(NC) 27(RSTN2) 28(BOOT_SEL2) 29(1PPS); U5 15(RESERVED) 16(RESERVED) 17(RESERVED)

### Layout directives
differential pair; net class USB: UB_D0_N, UB_D0_P, UB_D1_N, UB_D1_P, UB_D_N, UB_D_P
net class POWER_NET_CLASS: 3V3, GND, RFGND, RFVCC, UGND

### Notes on the sheet
- GPS
- X =
- f
- c
- 2πRC
- 1
- 10R1 for 1575 MHz
- (near R?#2) 12R9 for 1227 MHz
- (near R?#1) ANT
- (near R?#2) RF
- (near R20) FIT ONLY 1 OF 3!!!
- (near R20) SPI Enabled if D_SEL low

### Library data of the parts
ANT1 ANT2 = ANT-U.FL: Generic U.FL connector with 1 ANT + 3 GND
C7-C9 C13 = C0603_100nF_16V: Ceramic capacitor; Voltage: 16V; Capacity: 100nF; Size: 0603; Value: 100nF
C10 C14 = C0805_1uF_25V: Ceramic capacitor; Voltage: 25V; Capacity: 1uF; Size: 0805; Value: 1uF
C11 C12 C_F = C0402_10pF_50V: Ceramic capacitor; Voltage: 50V; Capacity: 10pF; Size: 0402; Value: 10pF
D4 = LED: as D1 on sheet 01-UART; SnapEDA_Link: https://www.snapeda.com/parts/598-8140-107F/Dialight/view-part/?ref=snap; Price: None; Availability: Unavailable; Package: 0805 Dialight; Value: *
L2 = L_CDRH4D18_10uH_0.61A: Inductor Generic; Value: *; Size: CDRH4D18; Url: http://www.kosmodrom.com.ua/el.php?name=CDRH4D18NP-100NC
P1 = CON-USB-Micro/Mini: as P9 on sheet 05-STM32; Availability: Unavailable; Package: None; MP: 440247-2; SnapEDA_Link: https://www.snapeda.com/parts/440247-2/TE%20Connectivity%20AMP%20Connectors/view-part/?ref=snap; TE_purchase_URL: https://www.te.com/usa-en/product-440247-2.html?te_bu=Cor&te_type=disp&te_campaign=seda_glo_cor-seda-global-disp-prtnr-fy19-seda-model-bom-cta_sma-317_1&elqCampaignId=32493; Price: None; Value: *
R11 = R0805_0R: Resistor General; Tolerance: *; Size: 0805
R12 = R0603_470R: Resistor General; Tolerance: 5%; Size: 0603
R13-R18 R?#1 R?#2 = R0402_0R: Resistor General; Tolerance: *; Size: 0402
R20 = RJ0603_10K: Resistor General; Tolerance: 5%; Size: 0603
R21 = R0603_0R: Resistor General; Tolerance: *; Size: 0603
U3 = NS-HP-GL: NS-HP-GL / S2525F8-GL-RTK in SMD
U4 = USBLC6-2: Very low capacitance ESD protection
U5 = NEO: u-blox NEO GNSS module; Part Description: u-blox GNSS module; Manufacturer: u-blox; Value: NEO-M8